# EasyEDA schematic Node Plant Project.json

## Sheets
1 DHT-11 & DHT-22: TITLE: Sheet_1; REV: 1.0; Date: 2024-01-26; Sheet: 1/1; Drawn By: robotic maker; Company: Your Company
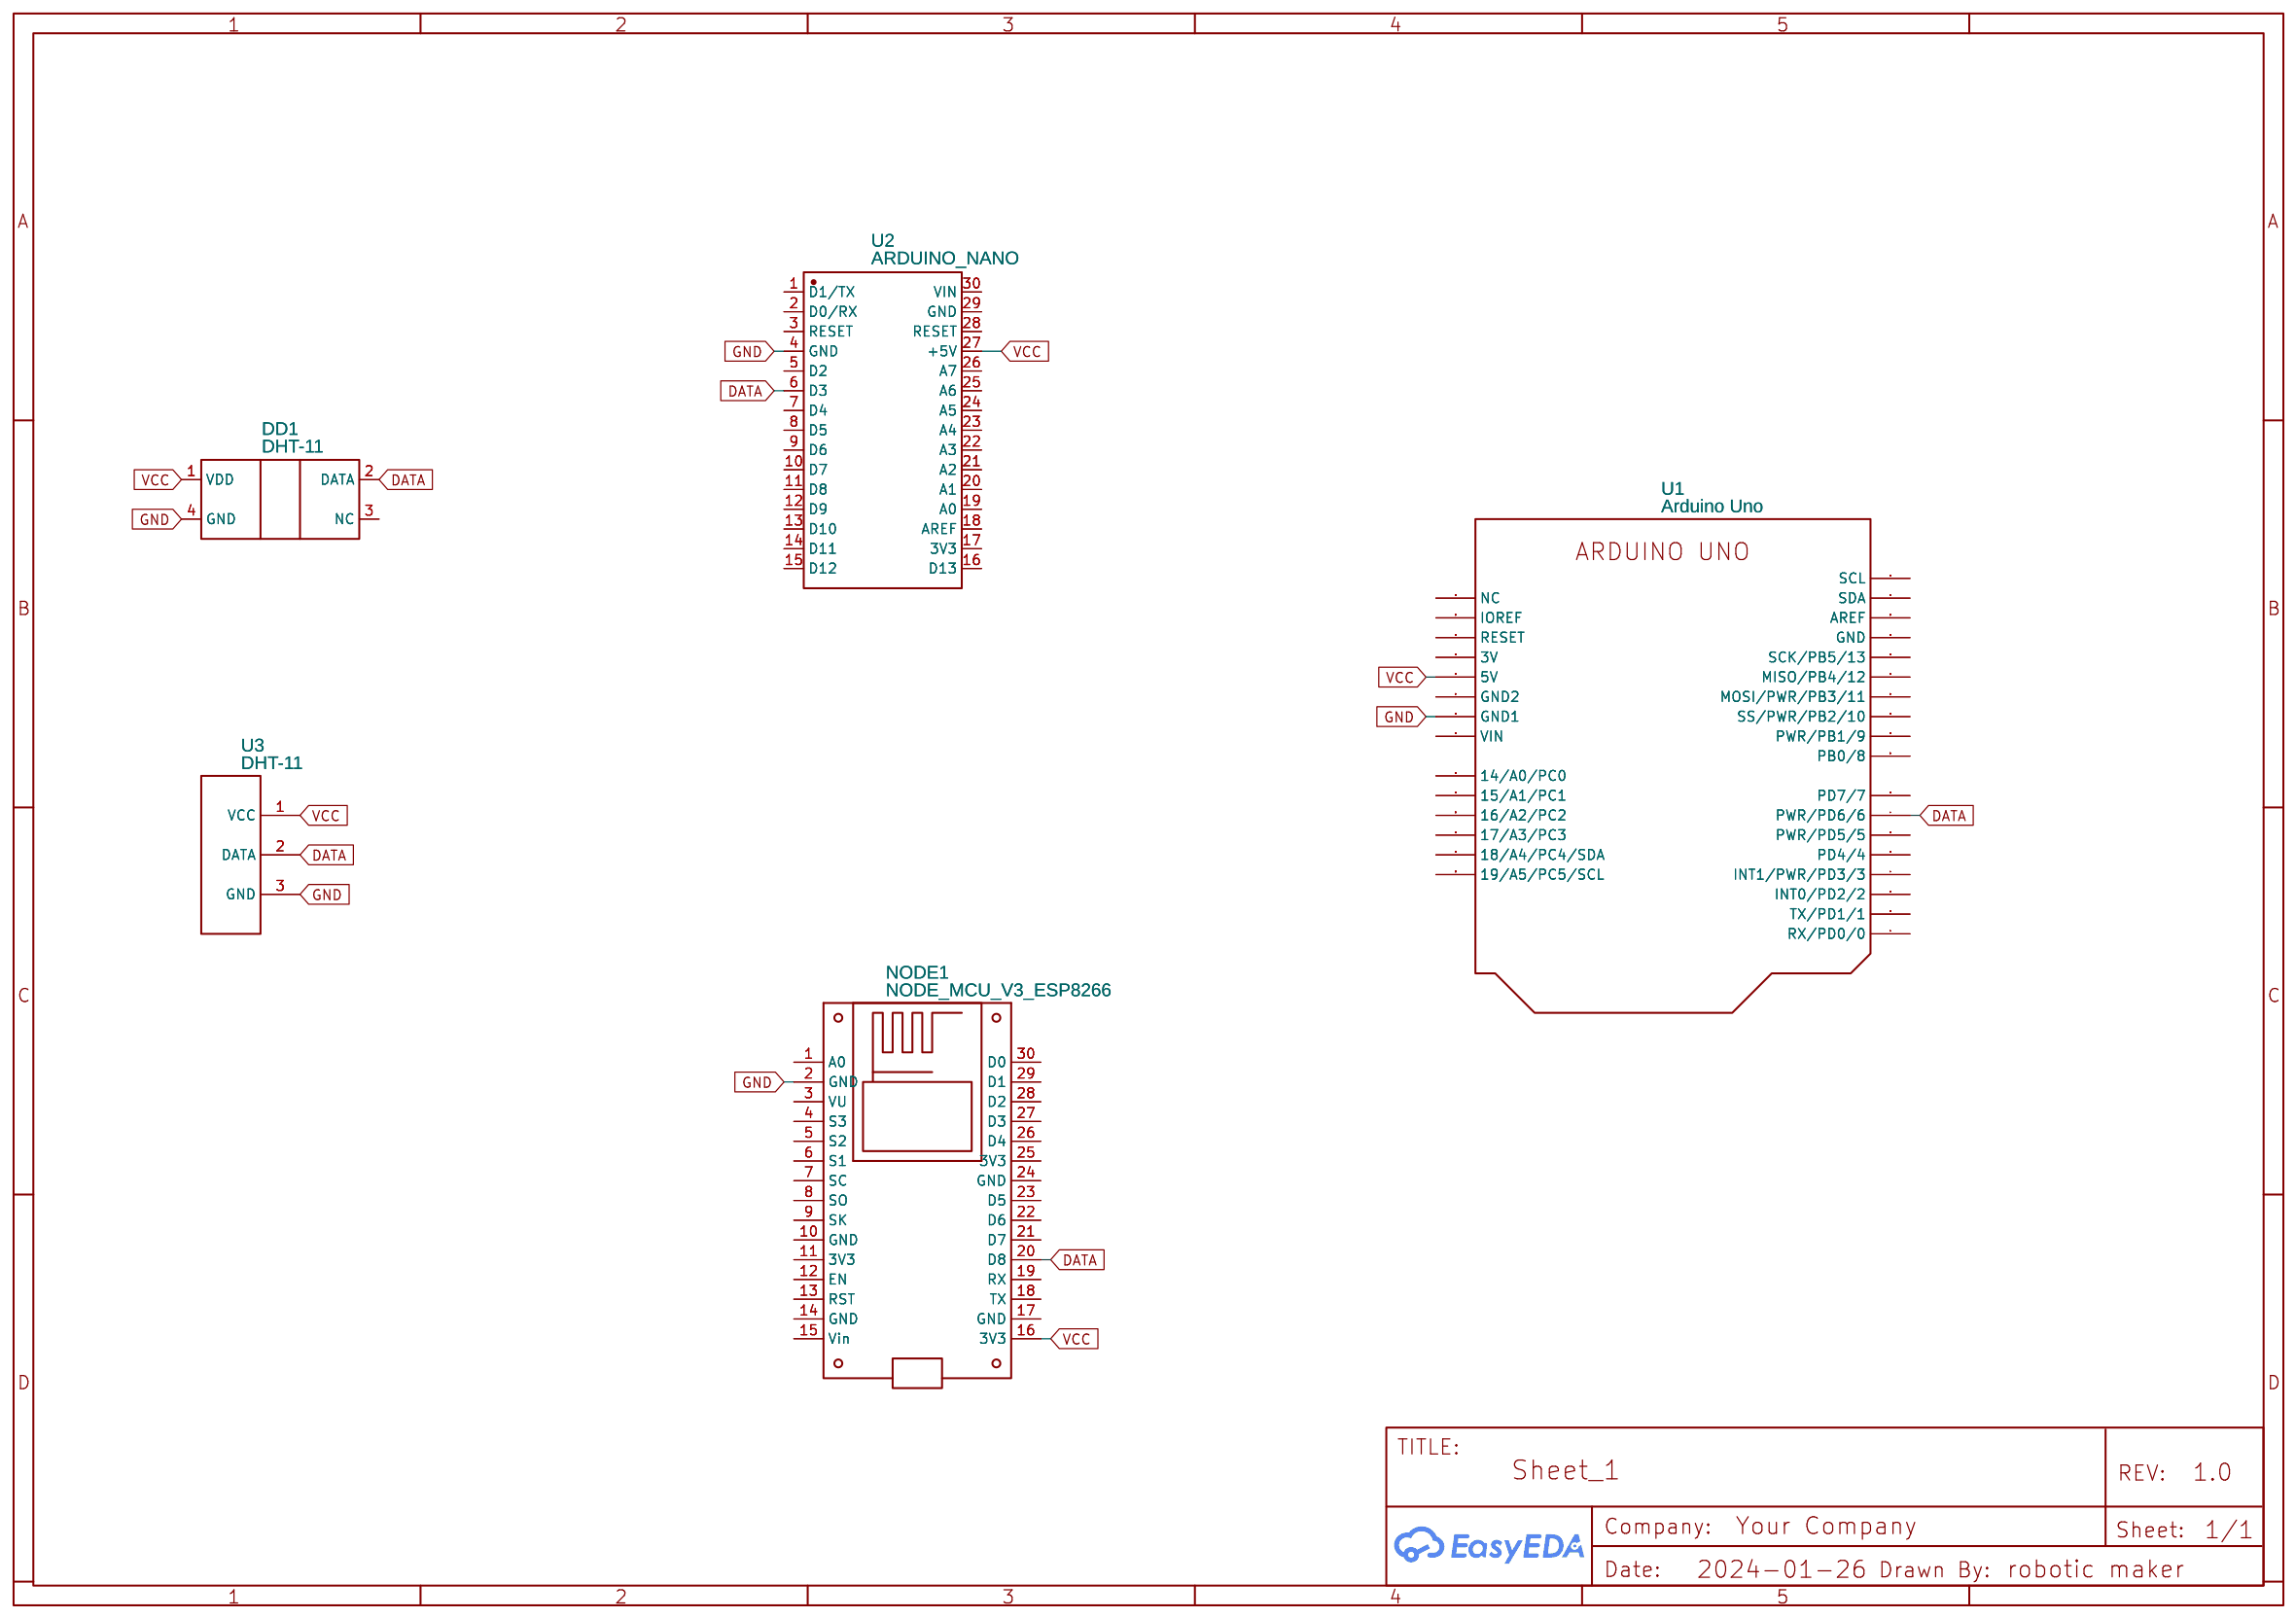
[diagram p0: DHT-11 & DHT-22]
2 Capacitive Soil Moisture Sensor
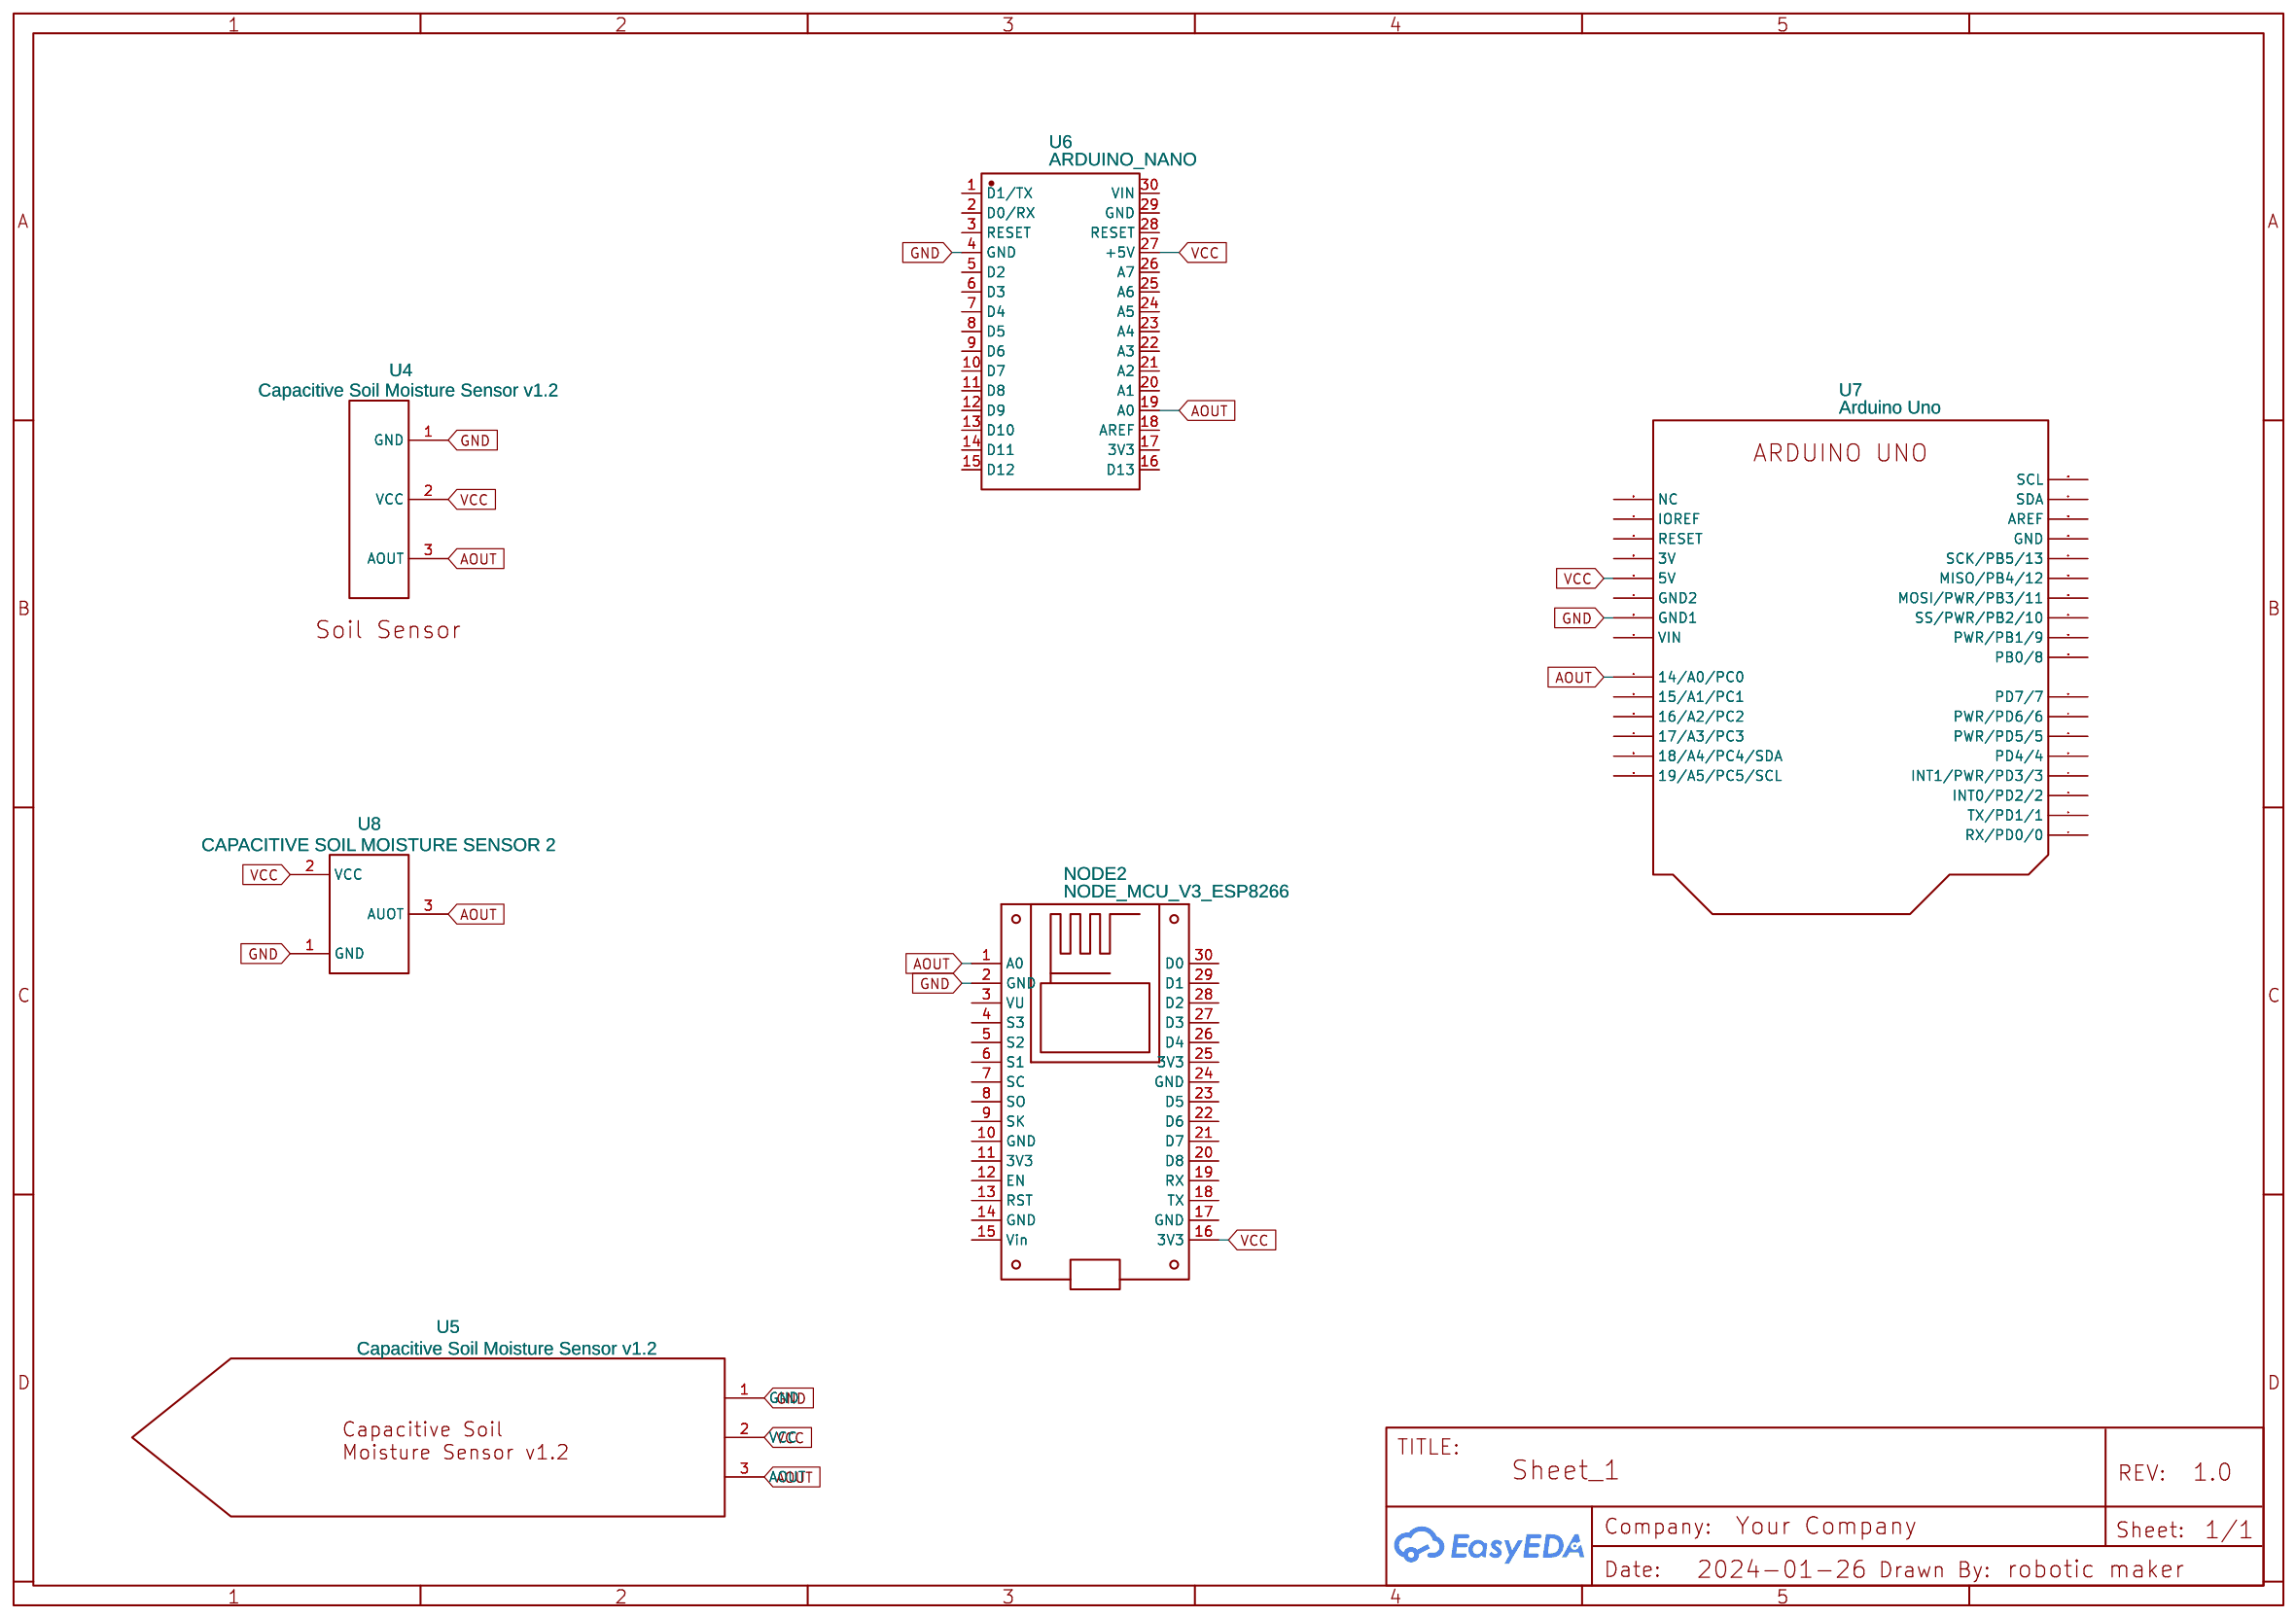
[diagram p1: Capacitive Soil Moisture Sensor]
3 Soil Moisture Sensor
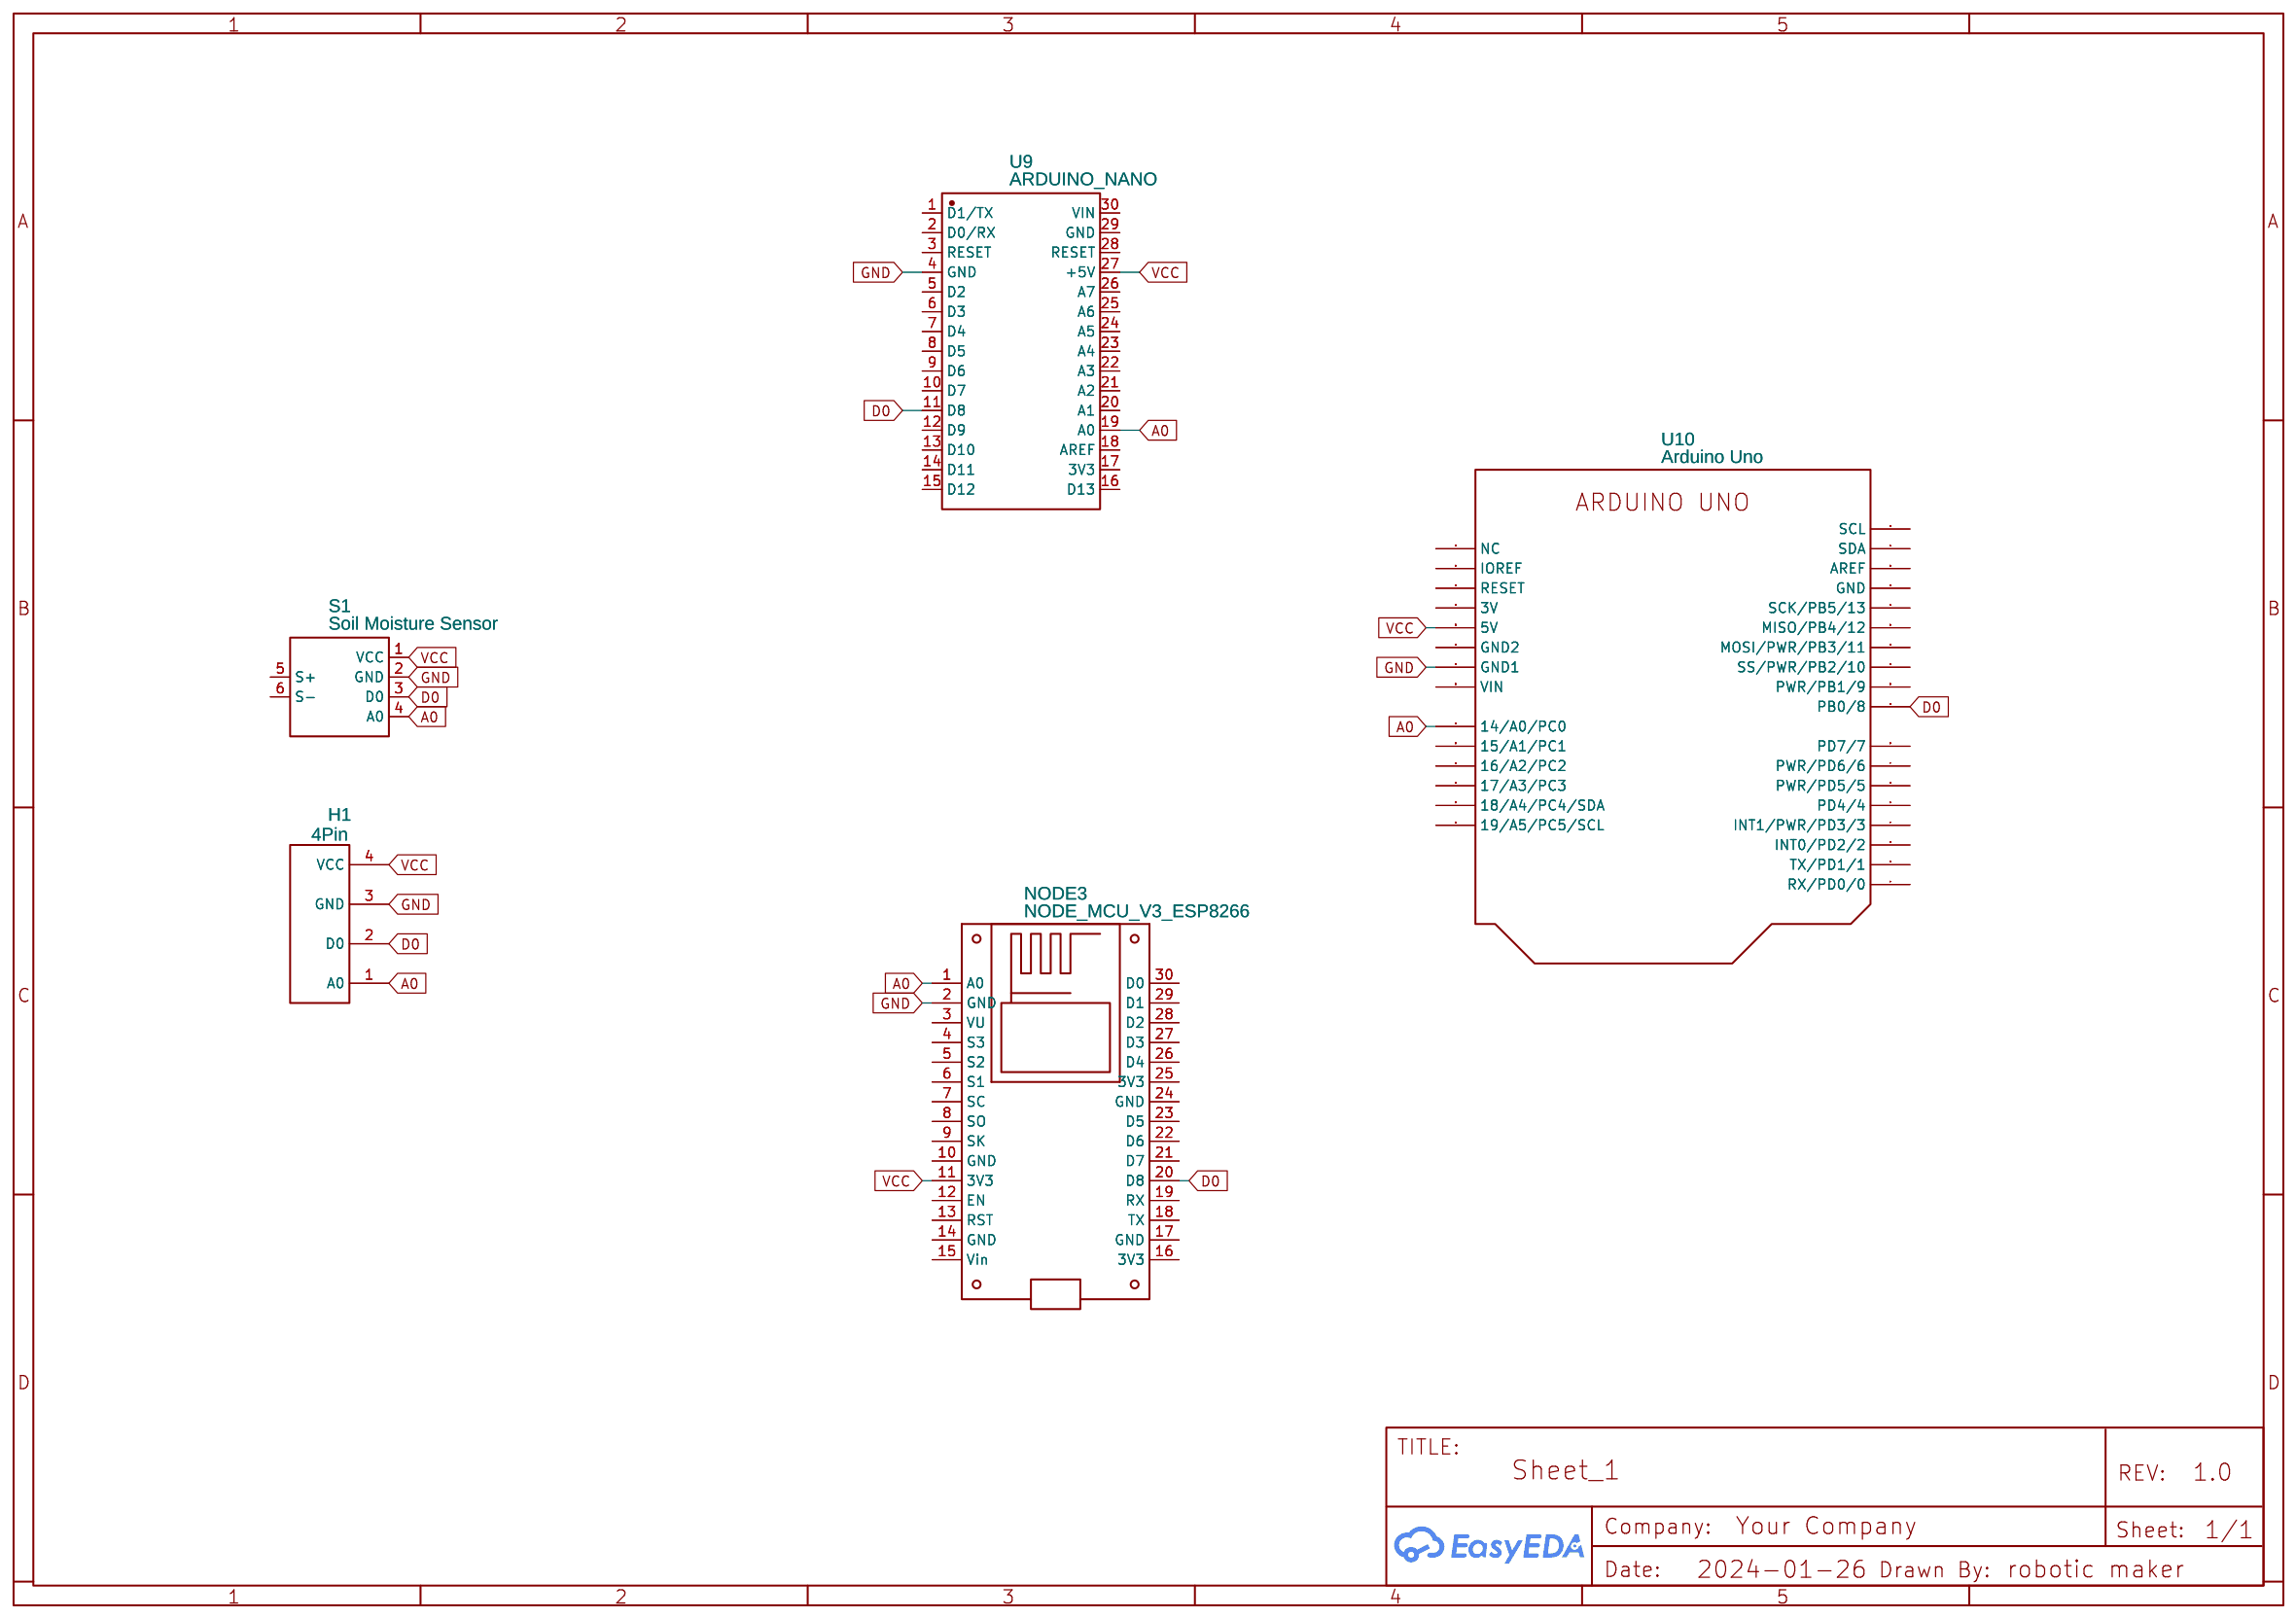
[diagram p2: Soil Moisture Sensor]
4 BH1750
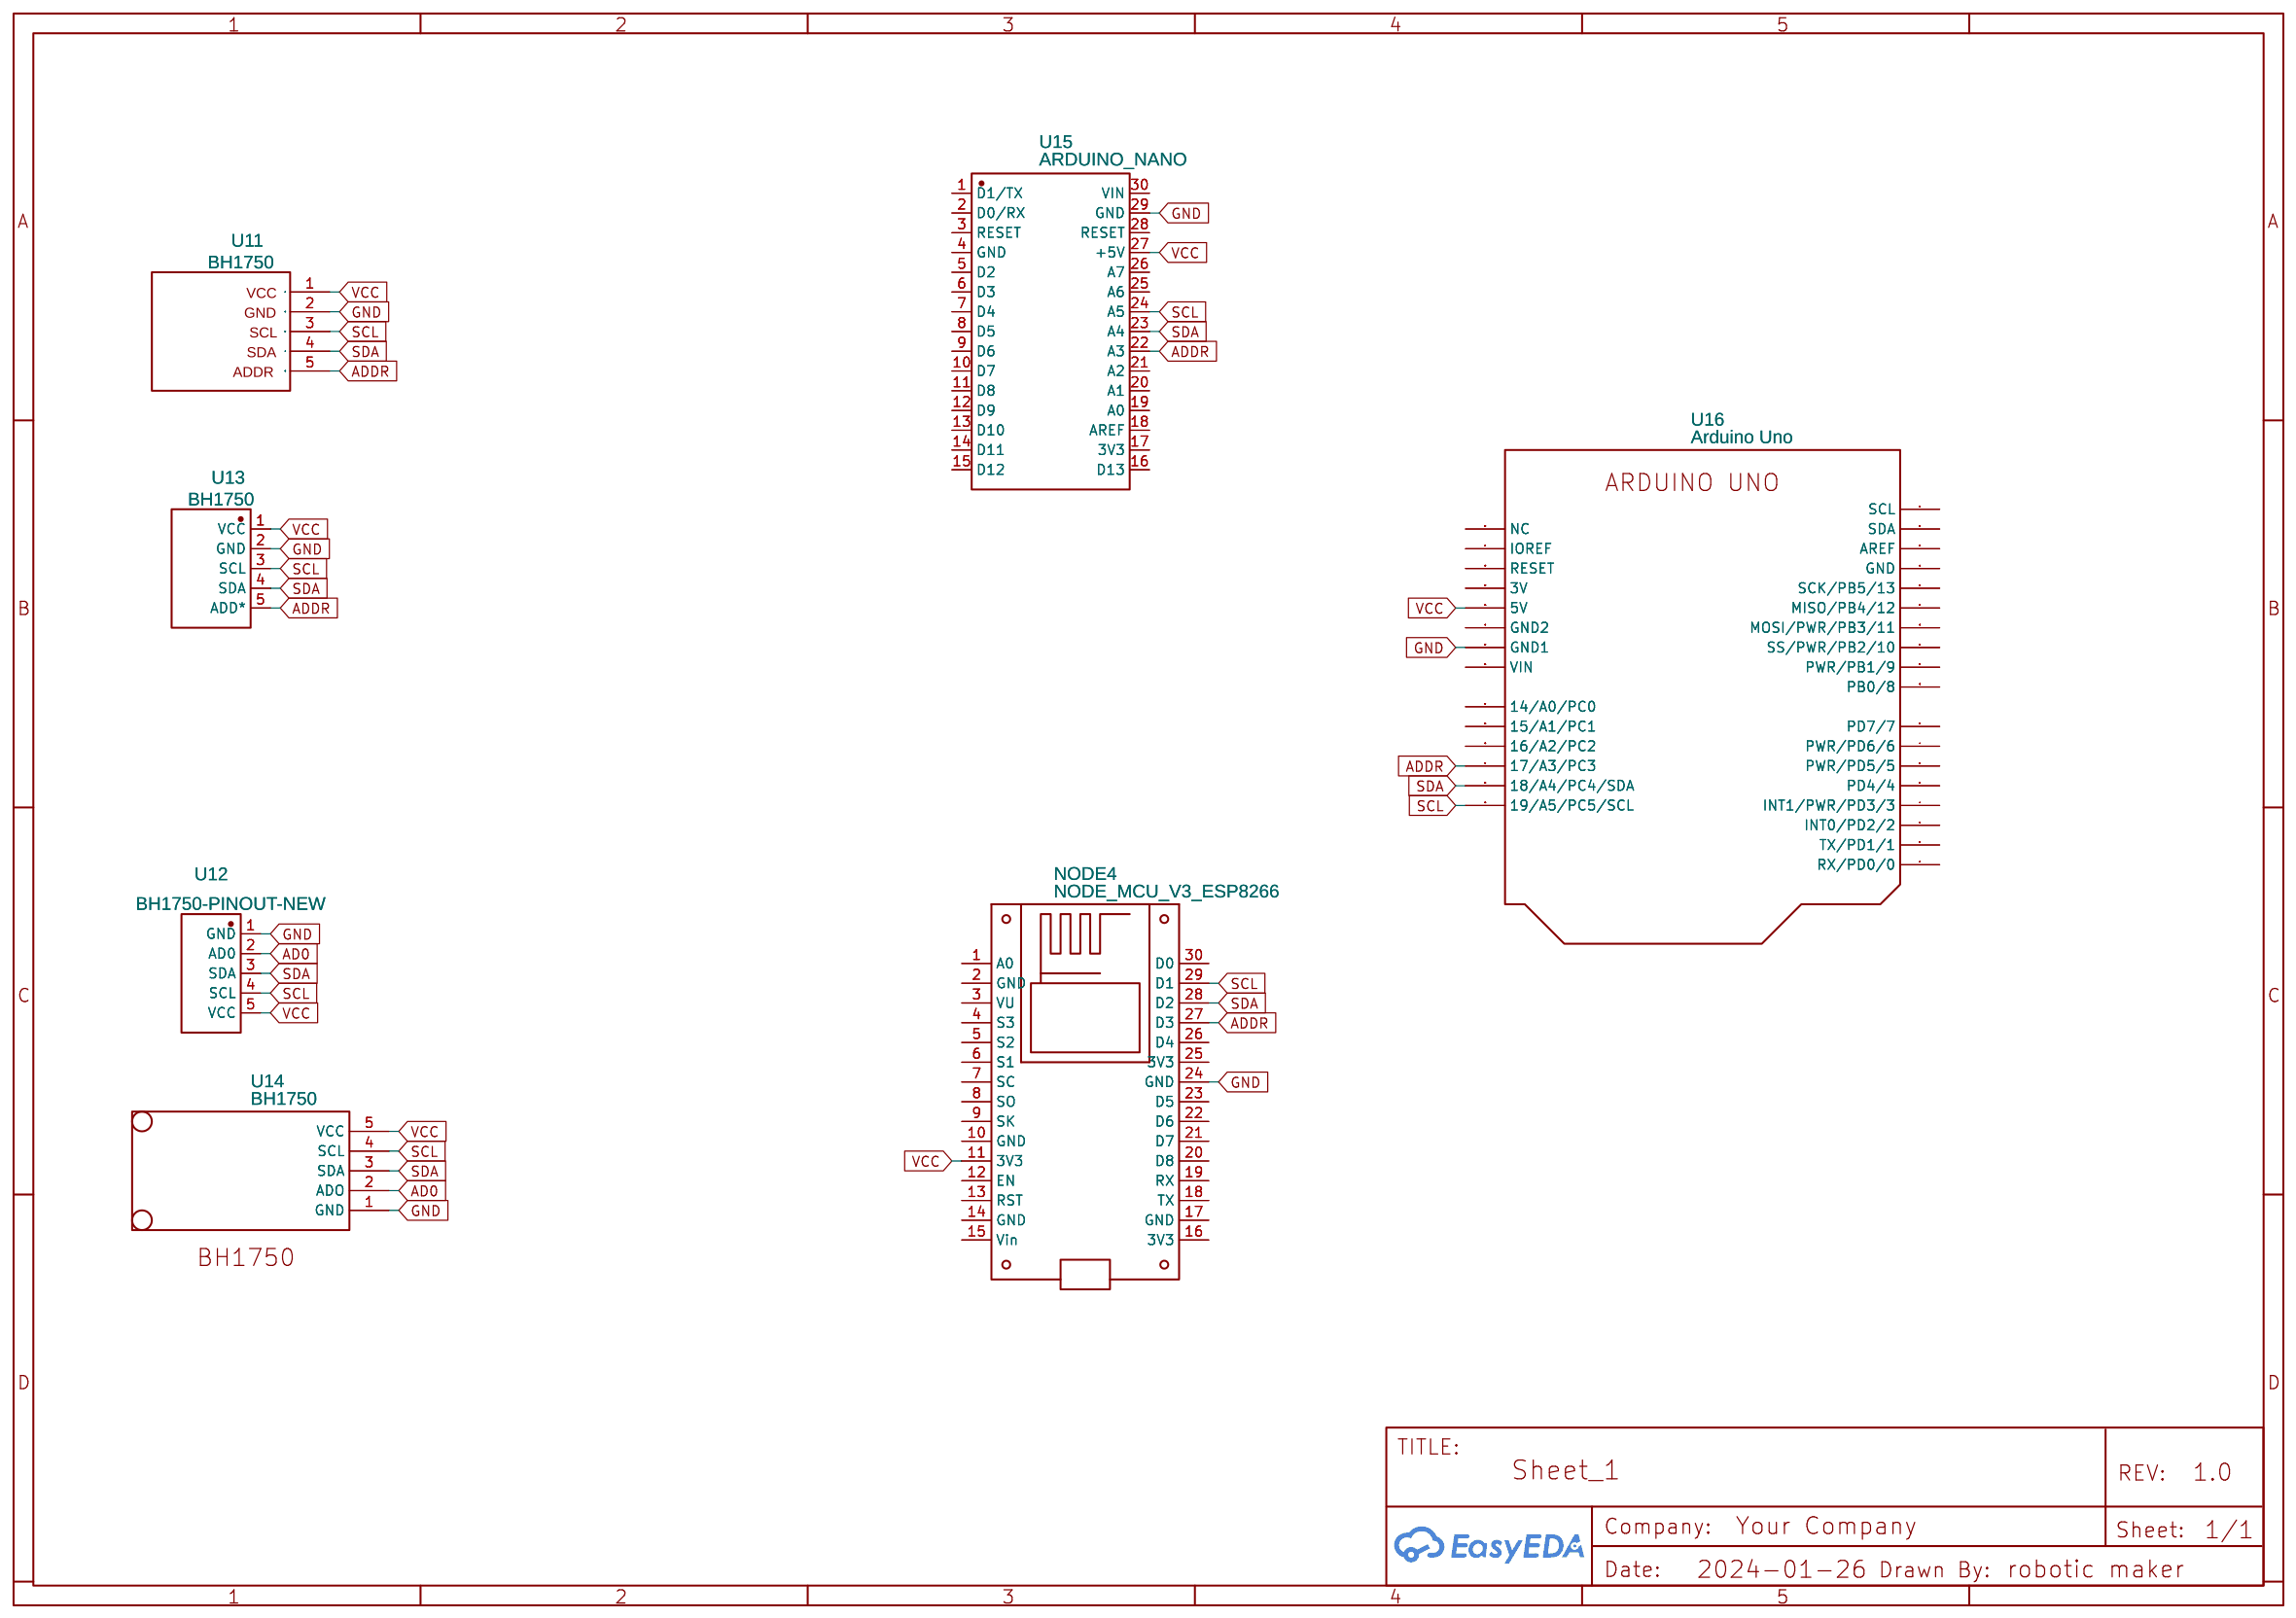
[diagram p3: BH1750]
5 Relay
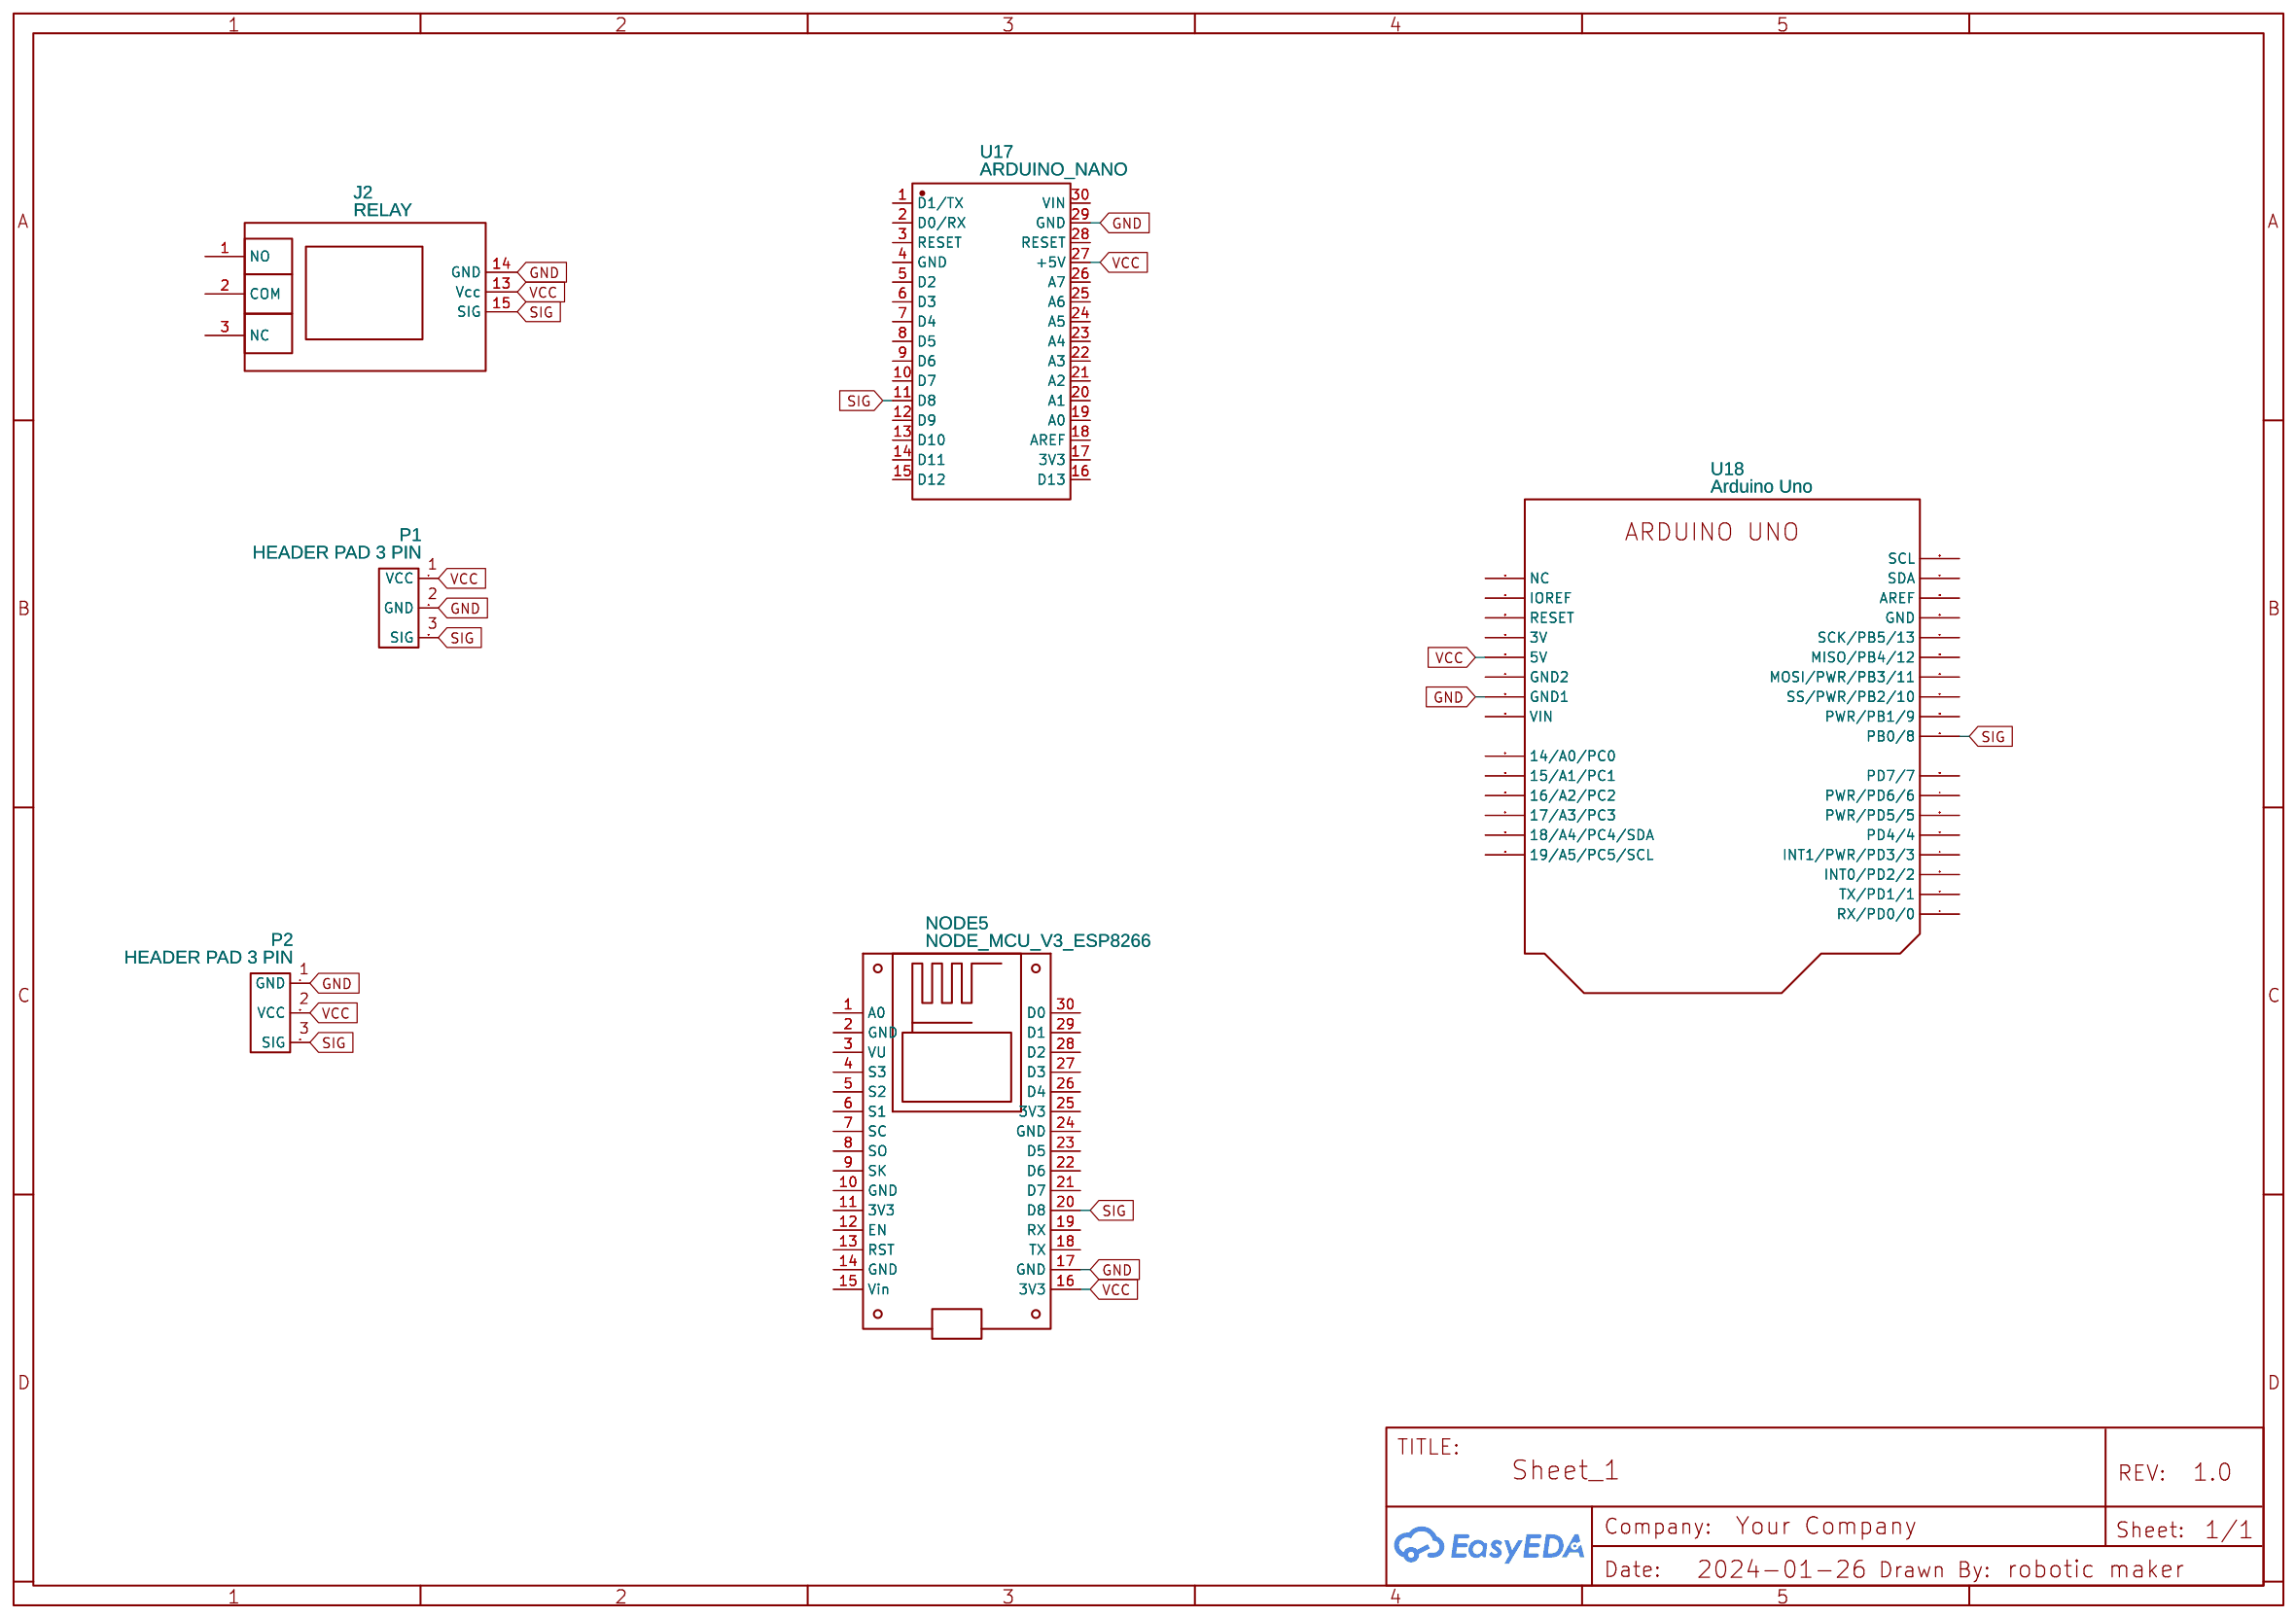
[diagram p4: Relay]
6 0.91 INCH OLED Display
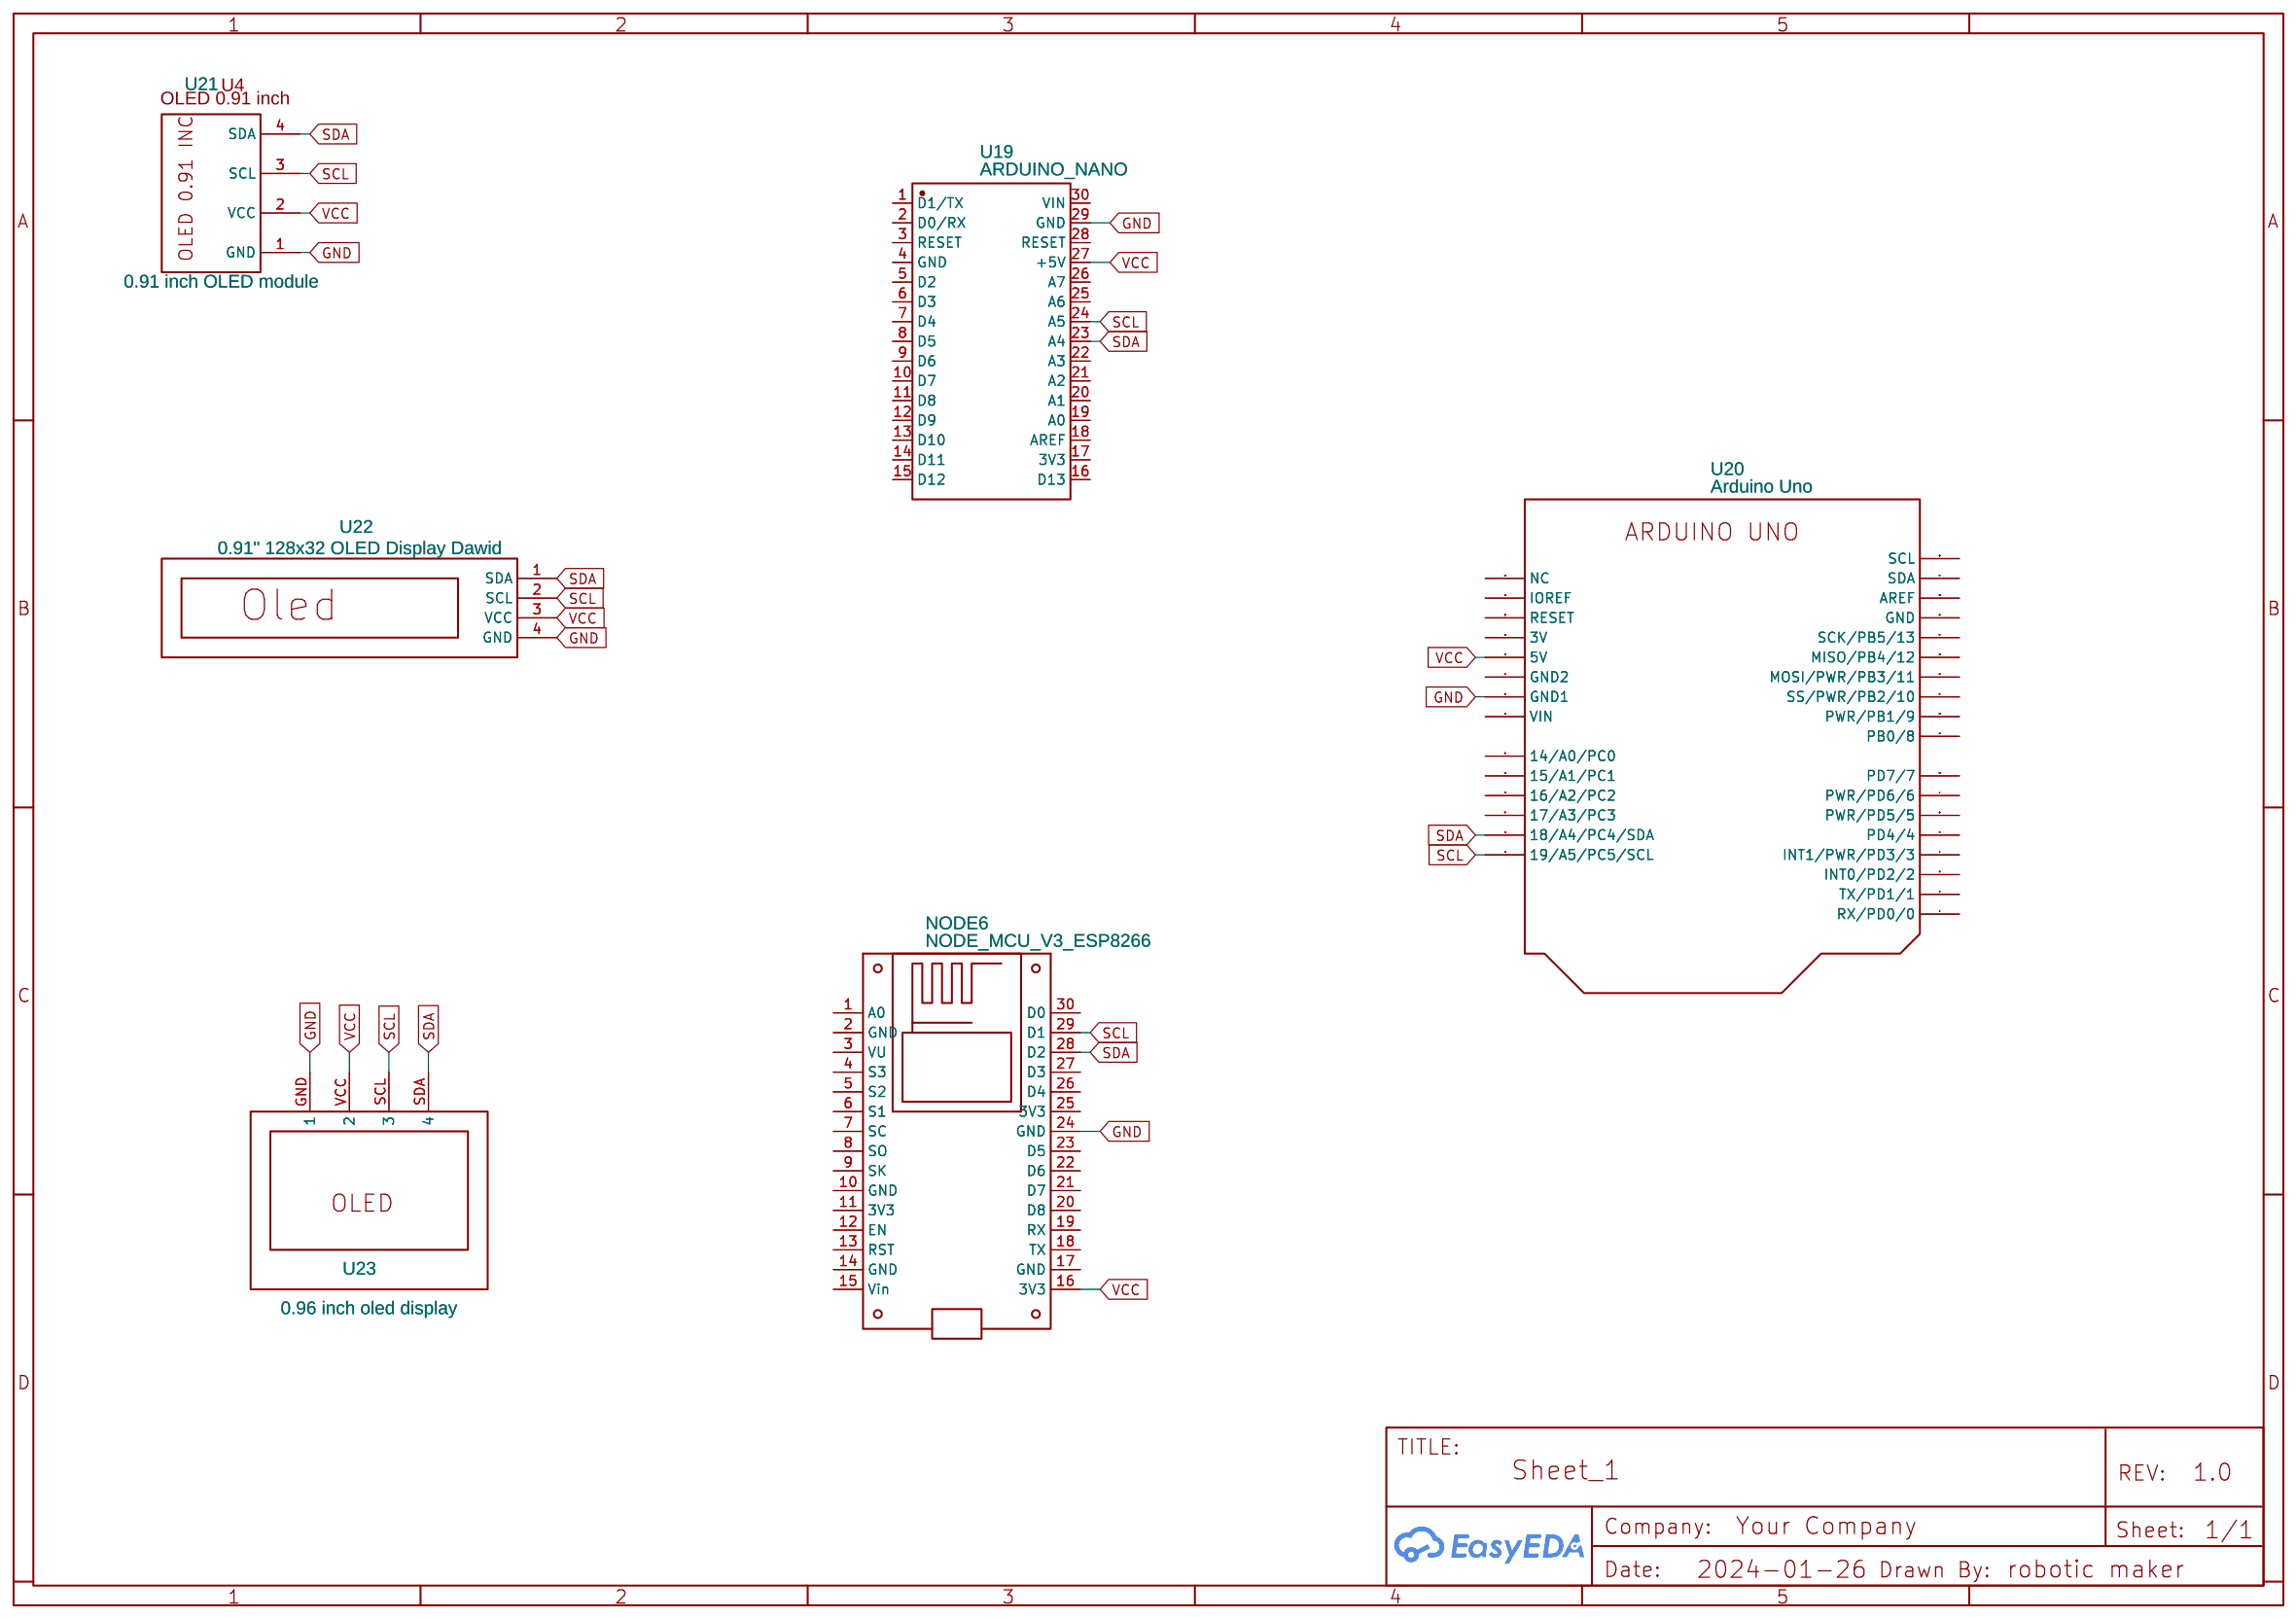
[diagram p5: 0.91 INCH OLED Display]
7 16X2 LCD Display
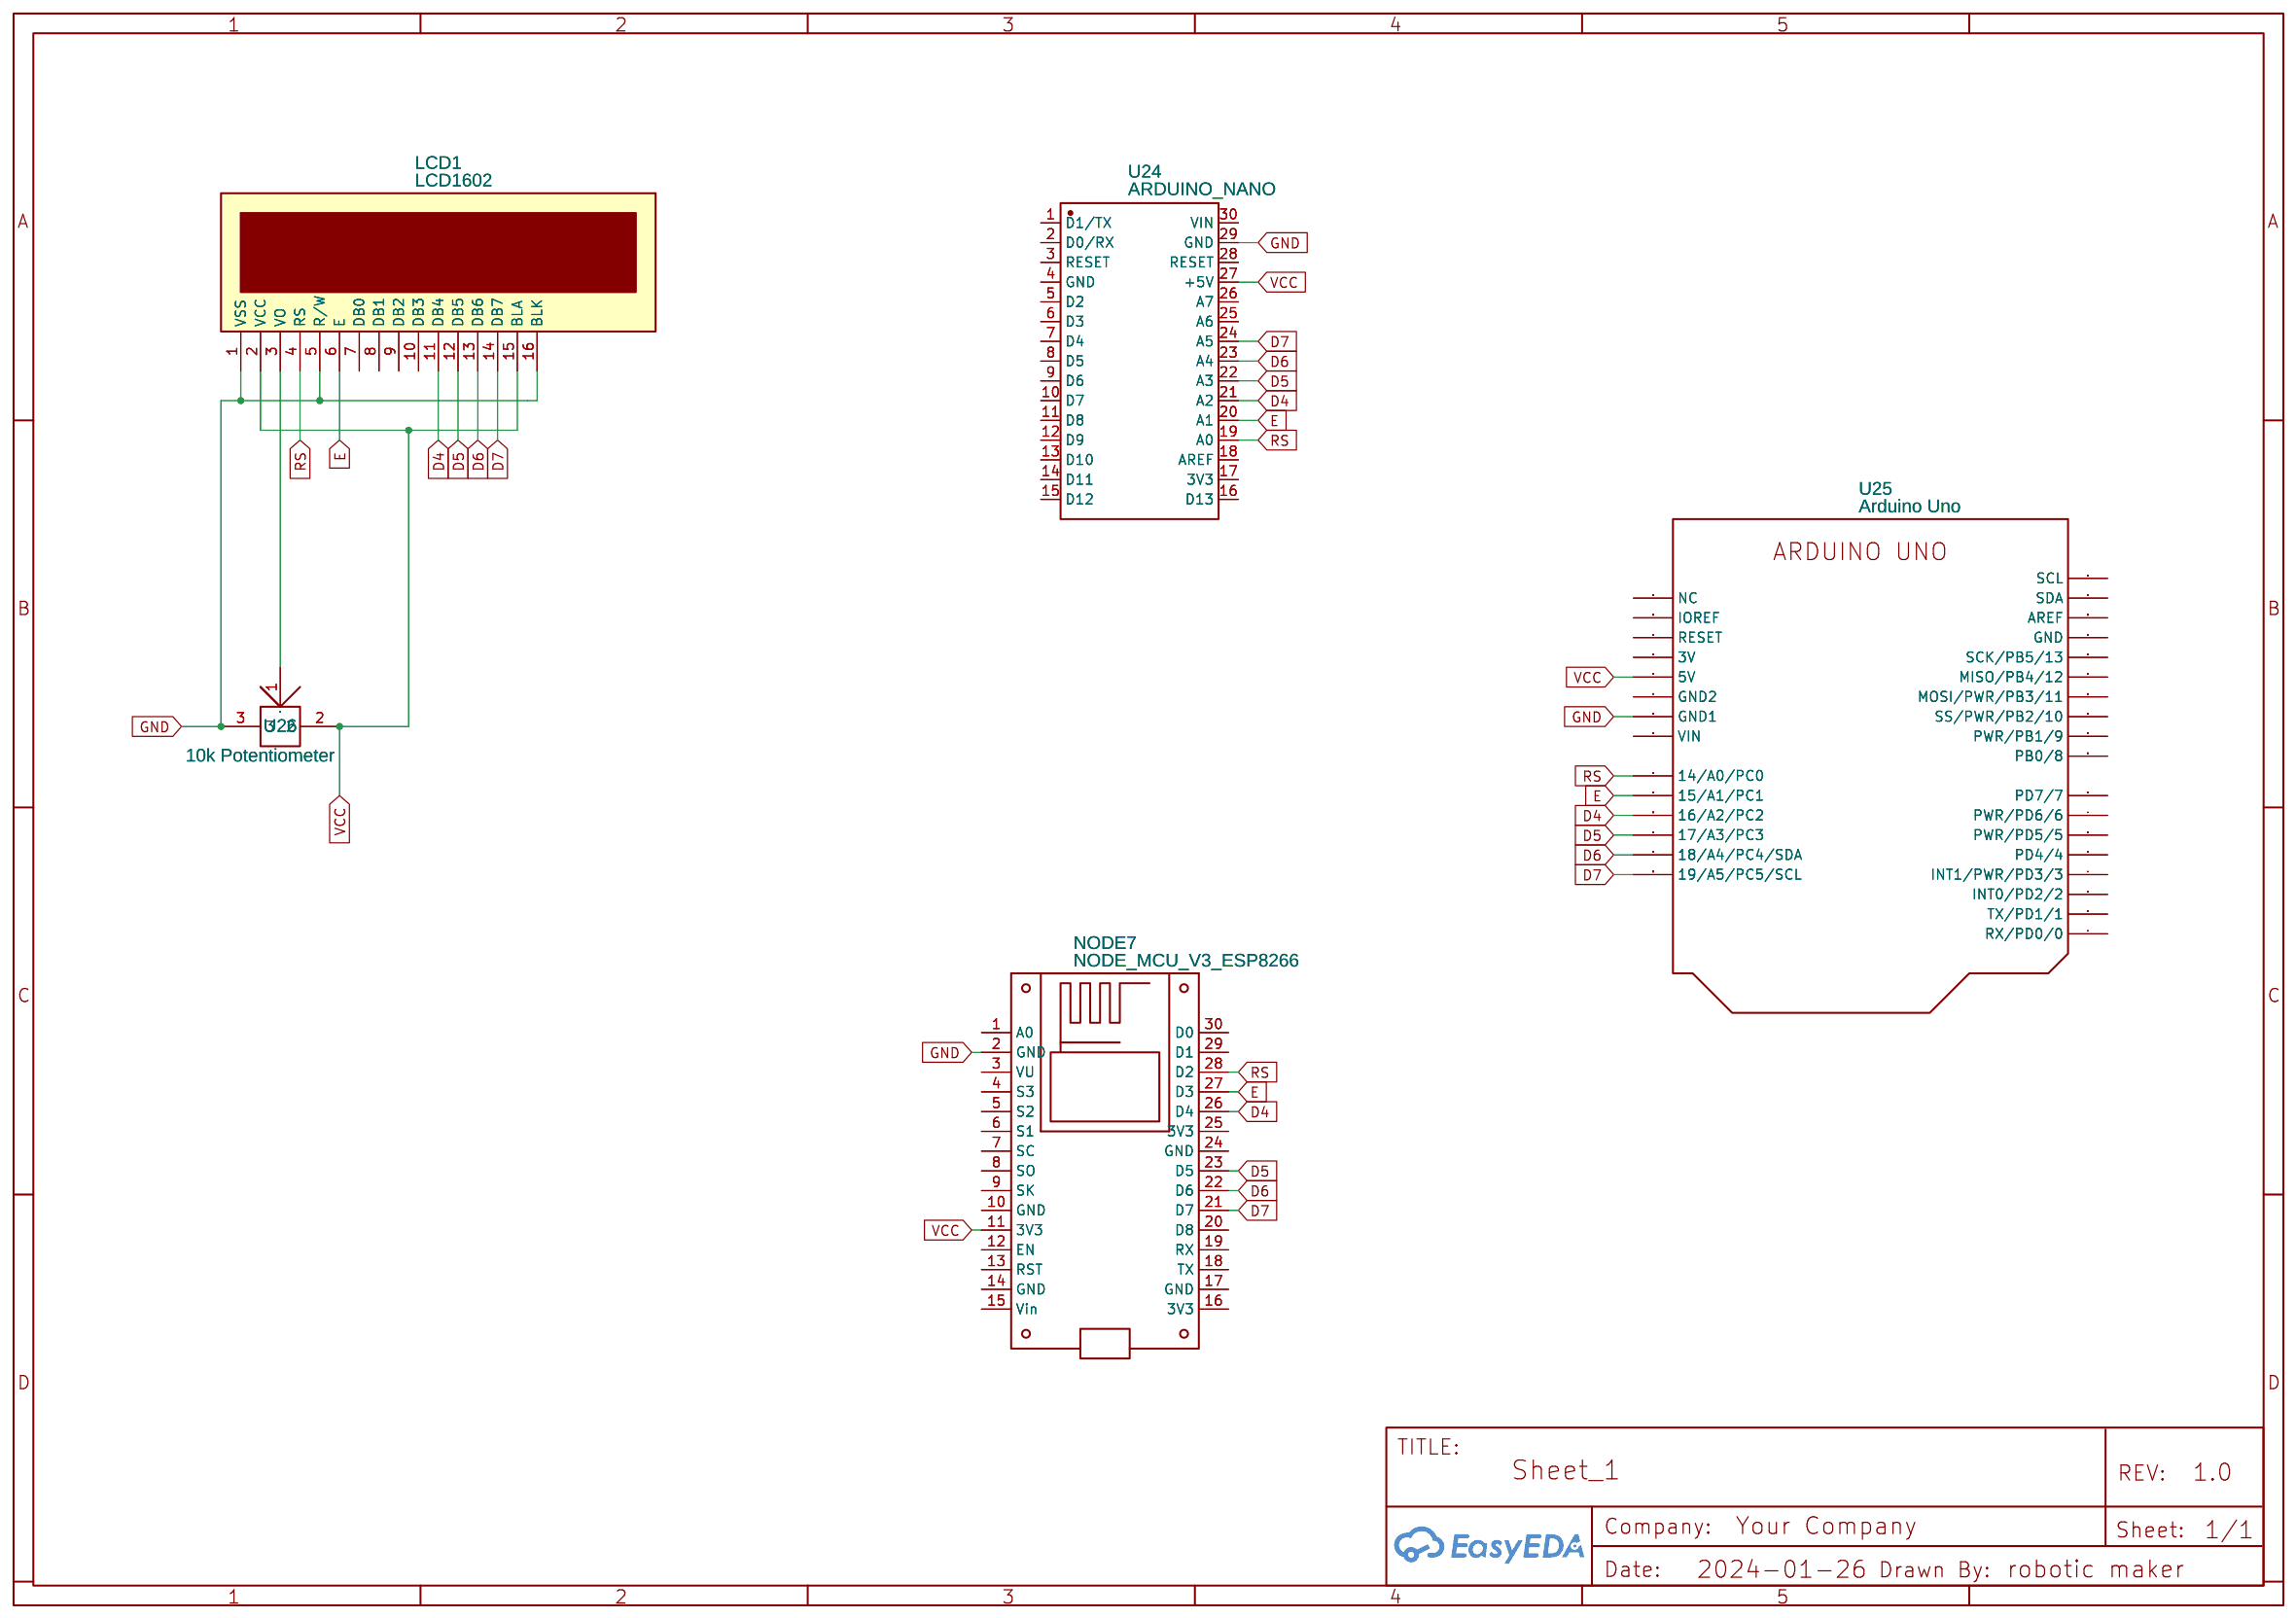
[diagram p6: 16X2 LCD Display]
8 16X2 LCD Display I2C
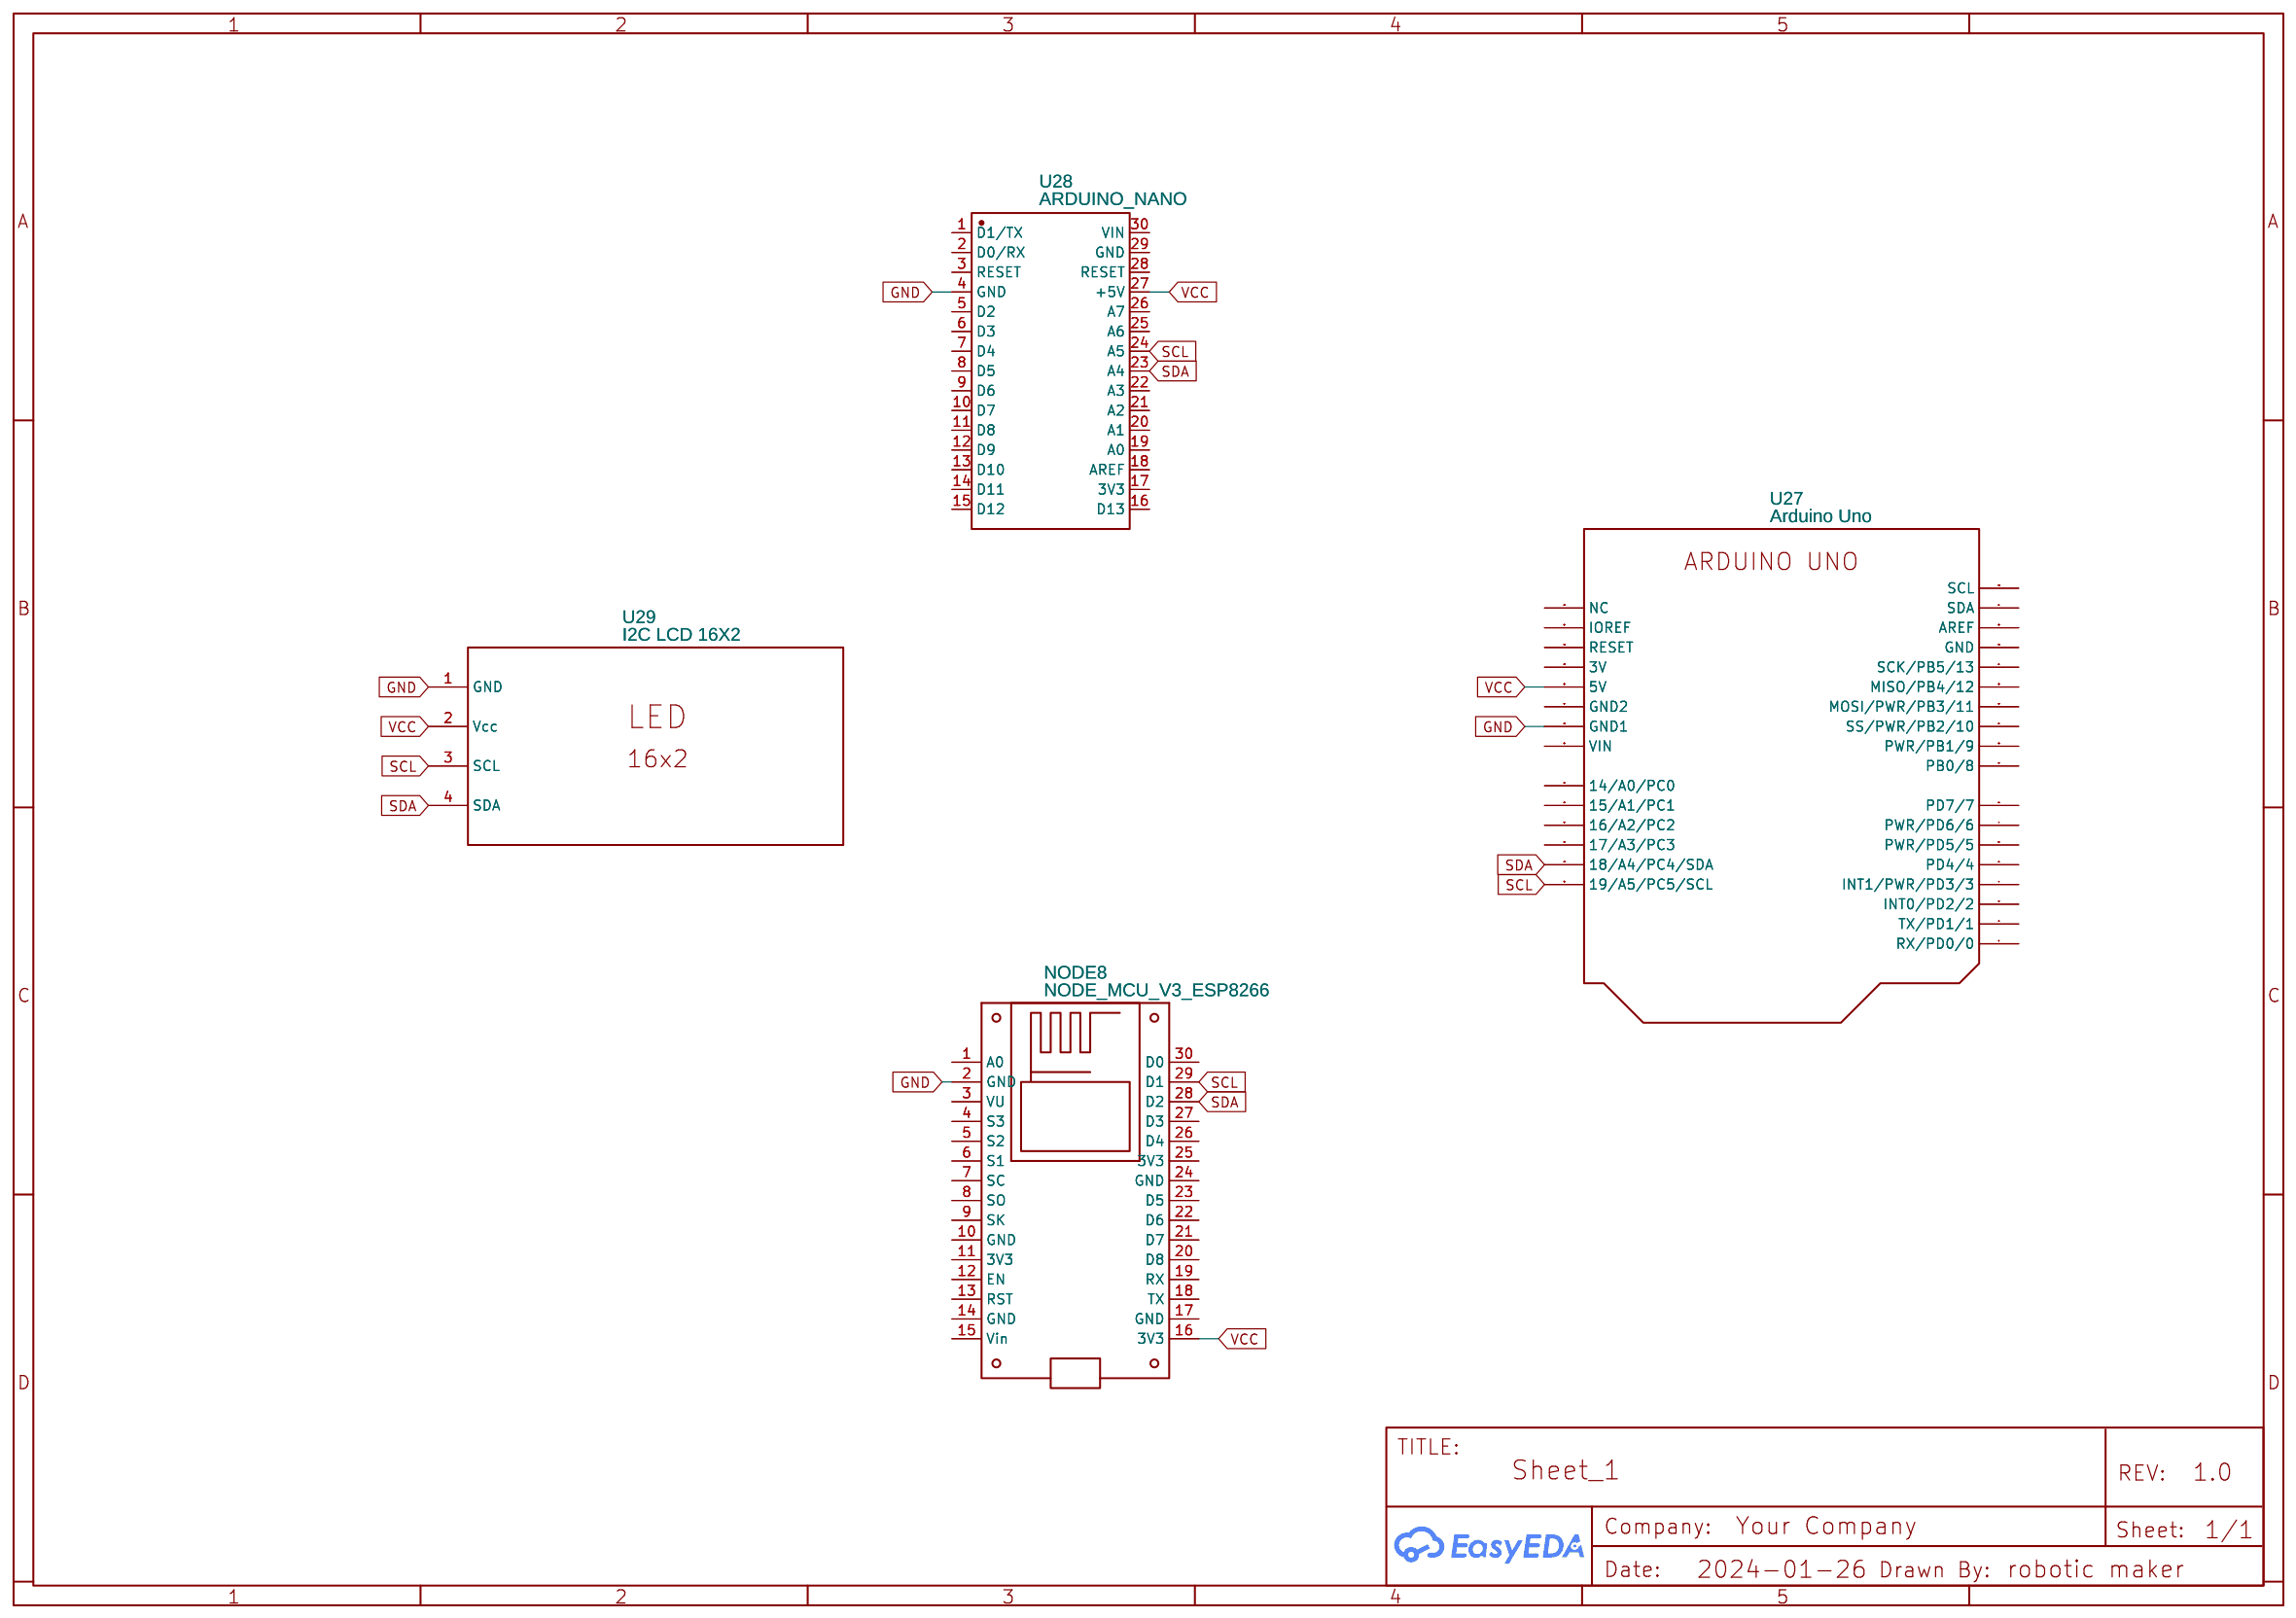
[diagram p7: 16X2 LCD Display I2C]

## Parts
sheet 0.91 INCH OLED Display
NODE6  NODE_MCU_V3_ESP8266  [NODEMCU-12E;NODEMCU-ESP8266]
U19  ARDUINO_NANO  [COMM-TH_ARDUINO_NANO]
U20  Arduino Uno  [UNO_R3;WO ARDUINO UNO]
U21  0.91 inch OLED module  [0.91 INCH OLED MODULE]
U22  0.91" 128x32 OLED Display Dawid  [0.91" 128X32 OLED DISPLAY DAWID]
U23  0.96 inch oled display  [0.96 INCH OLED DISPLAY]
sheet 16X2 LCD Display I2C
NODE8  NODE_MCU_V3_ESP8266  [NODEMCU-12E;NODEMCU-ESP8266]
U27  Arduino Uno  [UNO_R3;WO ARDUINO UNO]
U28  ARDUINO_NANO  [COMM-TH_ARDUINO_NANO]
U29  I2C LCD 16X2  [LCD_16X2_I2C_V2]
sheet 16X2 LCD Display
LCD1  LCD1602  [LCD1602]
NODE7  NODE_MCU_V3_ESP8266  [NODEMCU-12E;NODEMCU-ESP8266]
U24  ARDUINO_NANO  [COMM-TH_ARDUINO_NANO]
U25  Arduino Uno  [UNO_R3;WO ARDUINO UNO]
U26  10k Potentiometer  [10K POTENTIOMETER]
sheet BH1750
NODE4  NODE_MCU_V3_ESP8266  [NODEMCU-12E;NODEMCU-ESP8266]
U11  BH1750  [BH1750]
U12  BH1750-PINOUT-NEW  [BH1750-PINOUT-F]
U13  BH1750  [BH1750_MODULE]
U14  BH1750  [BH1750]
U15  ARDUINO_NANO  [COMM-TH_ARDUINO_NANO]
U16  Arduino Uno  [UNO_R3;WO ARDUINO UNO]
sheet Capacitive Soil Moisture Sensor
NODE2  NODE_MCU_V3_ESP8266  [NODEMCU-12E;NODEMCU-ESP8266]
U4  Capacitive Soil Moisture Sensor v1.2  [CAPACITIVE SOIL MOISTURE SENSOR V1.2 PCB]
U5  Capacitive Soil Moisture Sensor v1.2
U6  ARDUINO_NANO  [COMM-TH_ARDUINO_NANO]
U7  Arduino Uno  [UNO_R3;WO ARDUINO UNO]
U8  CAPACITIVE SOIL MOISTURE SENSOR 2  [CAPACITIVE SOIL MOISTURE SENSOR LAYOUT 2]
sheet DHT-11 & DHT-22
DD1  DHT-11  [DHT11F]
NODE1  NODE_MCU_V3_ESP8266  [NODEMCU-12E;NODEMCU-ESP8266]
U1  Arduino Uno  [UNO_R3;WO ARDUINO UNO]
U2  ARDUINO_NANO  [COMM-TH_ARDUINO_NANO]
U3  DHT-11  [DHT-11]
sheet Relay
J2  RELAY  [RELAY MODULE 1 RELAYS]
NODE5  NODE_MCU_V3_ESP8266  [NODEMCU-12E;NODEMCU-ESP8266]
P1  HEADER PAD 3 PIN  [CONNECTOR_PINHEADER_2.54MM:PINHEADER_1X3]
P2  HEADER PAD 3 PIN  [CONNECTOR_PINHEADER_2.54MM:PINHEADER_1X3]
U17  ARDUINO_NANO  [COMM-TH_ARDUINO_NANO]
U18  Arduino Uno  [UNO_R3;WO ARDUINO UNO]
sheet Soil Moisture Sensor
H1  4Pin  [HEADERPIN4PIN]
NODE3  NODE_MCU_V3_ESP8266  [NODEMCU-12E;NODEMCU-ESP8266]
S1  Soil Moisture Sensor  [SOIL MOISTURE SENSOR]
U9  ARDUINO_NANO  [COMM-TH_ARDUINO_NANO]
U10  Arduino Uno  [UNO_R3;WO ARDUINO UNO]

## Library data of the parts
NODE1-NODE8 = NODE_MCU_V3_ESP8266: Contributor: Denis09; Supplier: TME
U2 U6 U9 U15 U17 U19 U24 U28 = ARDUINO_NANO: Contributor: lcsc; Supplier: LCSC; Supplier Part: C9900017879; Manufacturer: null; JLCPCB Part Class: Extended Part
U1 U7 U10 U16 U18 U20 U25 U27 = Arduino Uno: Contributor: Peter Story; sourceId: frlCUcuMG
U21 = 0.91 inch OLED module: Contributor: Мурат Еньков
U22 = 0.91" 128x32 OLED Display Dawid: Contributor: dawidbredenkamp
U23 = 0.96 inch oled display: Contributor: noorul_haque
U29 = I2C LCD 16X2: Contributor: vipe
LCD1 = LCD1602: Manufacturer: LONTECH(厦门龙特); Manufacturer Part: LCM1602K-NSW-BBW; Supplier Part: C83275; Supplier: LCSC; Contributor: LCEDA_Lib
U26 = 10k Potentiometer: Contributor: Sagar Karnewar
U11 = BH1750: Contributor: jesuschoy
U12 = BH1750-PINOUT-NEW: Manufacturer Part: New SchematicLib; Contributor: sm94126; Supplier: Tinytronics
U13 = BH1750: Contributor: dwipanjan
U14 = BH1750: Supplier: RS-Online; Contributor: SRY TIS
U4 = Capacitive Soil Moisture Sensor v1.2: Contributor: Pablo Avila
U5 = Capacitive Soil Moisture Sensor v1.2: Contributor: Franiel
U8 = CAPACITIVE SOIL MOISTURE SENSOR 2: Contributor: phatcomp_it
DD1 = DHT-11: Contributor: perchik36
U3 = DHT-11: Contributor: UzainYasin
J2 = RELAY: Manufacturer Part: 1-Channel 5V Relay Module w/ Opto-isolator; Supplier Part: SKU: 223429; link: http://www.volumerate.com/product/1-channel-5v-relay-module-w-opto-isolator-red-blue-223429; Contributor: Jehangirkhan
P1 P2 = HEADER PAD 3 PIN: Supplier: LCSC; Manufacturer: BOOMELE; Manufacturer Part: Female headerHDR1X8-2.54; Supplier Part: C27438; JLCPCB Part Class: Extended Part; Contributor: vincentboisselier
H1 = 4Pin: Supplier: Hestore; Supplier Part: ZL201; Contributor: hunkrekker
S1 = Soil Moisture Sensor: Contributor: r.teerapong5456

## Nets
GND: DD1.4(GND) H1.3(GND) J2.14(GND) LCD1.1(VSS) LCD1.5(R/W) LCD1.16(BLK) NODE1.2(GND) NODE2.2(GND) NODE3.2(GND) NODE4.24(GND) NODE5.17(GND) NODE6.24(GND) NODE7.2(GND) NODE8.2(GND) P1.2(GND) P2.1(GND) S1.2(GND) U1.26(GND1) U2.4(GND) U3.3(GND) U4.1(GND) U6.4(GND) U7.26(GND1) U8.1(GND) U9.4(GND) U10.26(GND1) U11.2 U12.1(GND) U13.2(GND) U14.1(GND) U15.29(GND) U16.26(GND1) U17.29(GND) U18.26(GND1) U19.29(GND) U20.26(GND1) U21.1(GND) U22.4(GND) U23.GND(1) U24.29(GND) U25.26(GND1) U26.3 U27.26(GND1) U28.4(GND) U29.1(GND)
VCC: DD1.1(VDD) H1.4(VCC) J2.13(Vcc) LCD1.2(VCC) LCD1.15(BLA) NODE1.16(3V3) NODE2.16(3V3) NODE3.11(3V3) NODE4.11(3V3) NODE5.16(3V3) NODE6.16(3V3) NODE7.11(3V3) NODE8.16(3V3) P1.1(VCC) P2.2(VCC) S1.1(VCC) U1.28(5V) U2.27(+5V) U3.1(VCC) U4.2(VCC) U6.27(+5V) U7.28(5V) U8.2(VCC) U9.27(+5V) U10.28(5V) U11.1 U12.5(VCC) U13.1(VCC) U14.5(VCC) U15.27(+5V) U16.28(5V) U17.27(+5V) U18.28(5V) U19.27(+5V) U20.28(5V) U21.2(VCC) U22.3(VCC) U23.VCC(2) U24.27(+5V) U25.28(5V) U26.2 U27.28(5V) U28.27(+5V) U29.2(Vcc)
A0: H1.1(A0) NODE3.1(A0) S1.4(A0) U9.19(A0) U10.24(14/A0/PC0)
AD0: U12.2(AD0) U14.2(ADO)
ADDR: NODE4.27(D3) U11.5 U13.5(ADD*) U15.22(A3) U16.21(17/A3/PC3)
AOUT: NODE2.1(A0) U4.3(AOUT) U6.19(A0) U7.24(14/A0/PC0) U8.3(AUOT)
D0: H1.2(D0) NODE3.20(D8) S1.3(D0) U9.11(D8) U10.9(PB0/8)
D4: LCD1.11(DB4) NODE7.26(D4) U24.21(A2) U25.22(16/A2/PC2)
D5: LCD1.12(DB5) NODE7.23(D5) U24.22(A3) U25.21(17/A3/PC3)
D6: LCD1.13(DB6) NODE7.22(D6) U24.23(A4) U25.20(18/A4/PC4/SDA)
D7: LCD1.14(DB7) NODE7.21(D7) U24.24(A5) U25.19(19/A5/PC5/SCL)
DATA: DD1.2(DATA) NODE1.20(D8) U1.7(PWR/PD6/6) U2.6(D3) U3.2(DATA)
E: LCD1.6(E) NODE7.27(D3) U24.20(A1) U25.23(15/A1/PC1)
RS: LCD1.4(RS) NODE7.28(D2) U24.19(A0) U25.24(14/A0/PC0)
SCL: NODE4.29(D1) NODE6.29(D1) NODE8.29(D1) U11.3 U12.4(SCL) U13.3(SCL) U14.4(SCL) U15.24(A5) U16.19(19/A5/PC5/SCL) U19.24(A5) U20.19(19/A5/PC5/SCL) U21.3(SCL) U22.2(SCL) U23.SCL(3) U27.19(19/A5/PC5/SCL) U28.24(A5) U29.3(SCL)
SDA: NODE4.28(D2) NODE6.28(D2) NODE8.28(D2) U11.4 U12.3(SDA) U13.4(SDA) U14.3(SDA) U15.23(A4) U16.20(18/A4/PC4/SDA) U19.23(A4) U20.20(18/A4/PC4/SDA) U21.4(SDA) U22.1(SDA) U23.SDA(4) U27.20(18/A4/PC4/SDA) U28.23(A4) U29.4(SDA)
SIG: J2.15(SIG) NODE5.20(D8) P1.3(SIG) P2.3(SIG) U17.11(D8) U18.9(PB0/8)
Net-(LCD1-3): LCD1.3(VO) U26.1

Not connected (* = marked no-connect by the designer): DD1 3(NC); J2 1(NO) 2(COM) 3(NC); LCD1 7(DB0) 8(DB1) 9(DB2) 10(DB3); NODE1 1(A0) 3(VU) 4(S3) 5(S2) 6(S1) 7(SC) 8(SO) 9(SK) 10(GND) 11(3V3) 12(EN) 13(RST) 14(GND) 15(Vin) 17(GND) 18(TX) 19(RX) 21(D7) 22(D6) 23(D5) 24(GND) 25(3V3) 26(D4) 27(D3) 28(D2) 29(D1) 30(D0); NODE2 3(VU) 4(S3) 5(S2) 6(S1) 7(SC) 8(SO) 9(SK) 10(GND) 11(3V3) 12(EN) 13(RST) 14(GND) 15(Vin) 17(GND) 18(TX) 19(RX) 20(D8) 21(D7) 22(D6) 23(D5) 24(GND) 25(3V3) 26(D4) 27(D3) 28(D2) 29(D1) 30(D0); NODE3 3(VU) 4(S3) 5(S2) 6(S1) 7(SC) 8(SO) 9(SK) 10(GND) 12(EN) 13(RST) 14(GND) 15(Vin) 16(3V3) 17(GND) 18(TX) 19(RX) 21(D7) 22(D6) 23(D5) 24(GND) 25(3V3) 26(D4) 27(D3) 28(D2) 29(D1) 30(D0); NODE4 1(A0) 2(GND) 3(VU) 4(S3) 5(S2) 6(S1) 7(SC) 8(SO) 9(SK) 10(GND) 12(EN) 13(RST) 14(GND) 15(Vin) 16(3V3) 17(GND) 18(TX) 19(RX) 20(D8) 21(D7) 22(D6) 23(D5) 25(3V3) 26(D4) 30(D0); NODE5 1(A0) 2(GND) 3(VU) 4(S3) 5(S2) 6(S1) 7(SC) 8(SO) 9(SK) 10(GND) 11(3V3) 12(EN) 13(RST) 14(GND) 15(Vin) 18(TX) 19(RX) 21(D7) 22(D6) 23(D5) 24(GND) 25(3V3) 26(D4) 27(D3) 28(D2) 29(D1) 30(D0); NODE6 1(A0) 2(GND) 3(VU) 4(S3) 5(S2) 6(S1) 7(SC) 8(SO) 9(SK) 10(GND) 11(3V3) 12(EN) 13(RST) 14(GND) 15(Vin) 17(GND) 18(TX) 19(RX) 20(D8) 21(D7) 22(D6) 23(D5) 25(3V3) 26(D4) 27(D3) 30(D0); NODE7 1(A0) 3(VU) 4(S3) 5(S2) 6(S1) 7(SC) 8(SO) 9(SK) 10(GND) 12(EN) 13(RST) 14(GND) 15(Vin) 16(3V3) 17(GND) 18(TX) 19(RX) 20(D8) 24(GND) 25(3V3) 29(D1) 30(D0); NODE8 1(A0) 3(VU) 4(S3) 5(S2) 6(S1) 7(SC) 8(SO) 9(SK) 10(GND) 11(3V3) 12(EN) 13(RST) 14(GND) 15(Vin) 17(GND) 18(TX) 19(RX) 20(D8) 21(D7) 22(D6) 23(D5) 24(GND) 25(3V3) 26(D4) 27(D3) 30(D0); S1 5(S+) 6(S-); U1 1(RX/PD0/0) 2(TX/PD1/1) 3(INT0/PD2/2) 4(INT1/PWR/PD3/3) 5(PD4/4) 6(PWR/PD5/5) 8(PD7/7) 9(PB0/8) 10(PWR/PB1/9) 11(SS/PWR/PB2/10) 12(MOSI/PWR/PB3/11) 13(MISO/PB4/12) 14(SCK/PB5/13) 15(GND) 16(AREF) 17(SDA) 18(SCL) 19(19/A5/PC5/SCL) 20(18/A4/PC4/SDA) 21(17/A3/PC3) 22(16/A2/PC2) 23(15/A1/PC1) 24(14/A0/PC0) 25(VIN) 27(GND2) 29(3V) 30(RESET) 31(IOREF) 32(NC); U2 1(D1/TX) 2(D0/RX) 3(RESET) 5(D2) 7(D4) 8(D5) 9(D6) 10(D7) 11(D8) 12(D9) 13(D10) 14(D11) 15(D12) 16(D13) 17(3V3) 18(AREF) 19(A0) 20(A1) 21(A2) 22(A3) 23(A4) 24(A5) 25(A6) 26(A7) 28(RESET) 29(GND) 30(VIN); U5 1(GND) 2(VCC) 3(AOUT); U6 1(D1/TX) 2(D0/RX) 3(RESET) 5(D2) 6(D3) 7(D4) 8(D5) 9(D6) 10(D7) 11(D8) 12(D9) 13(D10) 14(D11) 15(D12) 16(D13) 17(3V3) 18(AREF) 20(A1) 21(A2) 22(A3) 23(A4) 24(A5) 25(A6) 26(A7) 28(RESET) 29(GND) 30(VIN); U7 1(RX/PD0/0) 2(TX/PD1/1) 3(INT0/PD2/2) 4(INT1/PWR/PD3/3) 5(PD4/4) 6(PWR/PD5/5) 7(PWR/PD6/6) 8(PD7/7) 9(PB0/8) 10(PWR/PB1/9) 11(SS/PWR/PB2/10) 12(MOSI/PWR/PB3/11) 13(MISO/PB4/12) 14(SCK/PB5/13) 15(GND) 16(AREF) 17(SDA) 18(SCL) 19(19/A5/PC5/SCL) 20(18/A4/PC4/SDA) 21(17/A3/PC3) 22(16/A2/PC2) 23(15/A1/PC1) 25(VIN) 27(GND2) 29(3V) 30(RESET) 31(IOREF) 32(NC); U9 1(D1/TX) 2(D0/RX) 3(RESET) 5(D2) 6(D3) 7(D4) 8(D5) 9(D6) 10(D7) 12(D9) 13(D10) 14(D11) 15(D12) 16(D13) 17(3V3) 18(AREF) 20(A1) 21(A2) 22(A3) 23(A4) 24(A5) 25(A6) 26(A7) 28(RESET) 29(GND) 30(VIN); U10 1(RX/PD0/0) 2(TX/PD1/1) 3(INT0/PD2/2) 4(INT1/PWR/PD3/3) 5(PD4/4) 6(PWR/PD5/5) 7(PWR/PD6/6) 8(PD7/7) 10(PWR/PB1/9) 11(SS/PWR/PB2/10) 12(MOSI/PWR/PB3/11) 13(MISO/PB4/12) 14(SCK/PB5/13) 15(GND) 16(AREF) 17(SDA) 18(SCL) 19(19/A5/PC5/SCL) 20(18/A4/PC4/SDA) 21(17/A3/PC3) 22(16/A2/PC2) 23(15/A1/PC1) 25(VIN) 27(GND2) 29(3V) 30(RESET) 31(IOREF) 32(NC); U15 1(D1/TX) 2(D0/RX) 3(RESET) 4(GND) 5(D2) 6(D3) 7(D4) 8(D5) 9(D6) 10(D7) 11(D8) 12(D9) 13(D10) 14(D11) 15(D12) 16(D13) 17(3V3) 18(AREF) 19(A0) 20(A1) 21(A2) 25(A6) 26(A7) 28(RESET) 30(VIN); U16 1(RX/PD0/0) 2(TX/PD1/1) 3(INT0/PD2/2) 4(INT1/PWR/PD3/3) 5(PD4/4) 6(PWR/PD5/5) 7(PWR/PD6/6) 8(PD7/7) 9(PB0/8) 10(PWR/PB1/9) 11(SS/PWR/PB2/10) 12(MOSI/PWR/PB3/11) 13(MISO/PB4/12) 14(SCK/PB5/13) 15(GND) 16(AREF) 17(SDA) 18(SCL) 22(16/A2/PC2) 23(15/A1/PC1) 24(14/A0/PC0) 25(VIN) 27(GND2) 29(3V) 30(RESET) 31(IOREF) 32(NC); U17 1(D1/TX) 2(D0/RX) 3(RESET) 4(GND) 5(D2) 6(D3) 7(D4) 8(D5) 9(D6) 10(D7) 12(D9) 13(D10) 14(D11) 15(D12) 16(D13) 17(3V3) 18(AREF) 19(A0) 20(A1) 21(A2) 22(A3) 23(A4) 24(A5) 25(A6) 26(A7) 28(RESET) 30(VIN); U18 1(RX/PD0/0) 2(TX/PD1/1) 3(INT0/PD2/2) 4(INT1/PWR/PD3/3) 5(PD4/4) 6(PWR/PD5/5) 7(PWR/PD6/6) 8(PD7/7) 10(PWR/PB1/9) 11(SS/PWR/PB2/10) 12(MOSI/PWR/PB3/11) 13(MISO/PB4/12) 14(SCK/PB5/13) 15(GND) 16(AREF) 17(SDA) 18(SCL) 19(19/A5/PC5/SCL) 20(18/A4/PC4/SDA) 21(17/A3/PC3) 22(16/A2/PC2) 23(15/A1/PC1) 24(14/A0/PC0) 25(VIN) 27(GND2) 29(3V) 30(RESET) 31(IOREF) 32(NC); U19 1(D1/TX) 2(D0/RX) 3(RESET) 4(GND) 5(D2) 6(D3) 7(D4) 8(D5) 9(D6) 10(D7) 11(D8) 12(D9) 13(D10) 14(D11) 15(D12) 16(D13) 17(3V3) 18(AREF) 19(A0) 20(A1) 21(A2) 22(A3) 25(A6) 26(A7) 28(RESET) 30(VIN); U20 1(RX/PD0/0) 2(TX/PD1/1) 3(INT0/PD2/2) 4(INT1/PWR/PD3/3) 5(PD4/4) 6(PWR/PD5/5) 7(PWR/PD6/6) 8(PD7/7) 9(PB0/8) 10(PWR/PB1/9) 11(SS/PWR/PB2/10) 12(MOSI/PWR/PB3/11) 13(MISO/PB4/12) 14(SCK/PB5/13) 15(GND) 16(AREF) 17(SDA) 18(SCL) 21(17/A3/PC3) 22(16/A2/PC2) 23(15/A1/PC1) 24(14/A0/PC0) 25(VIN) 27(GND2) 29(3V) 30(RESET) 31(IOREF) 32(NC); U24 1(D1/TX) 2(D0/RX) 3(RESET) 4(GND) 5(D2) 6(D3) 7(D4) 8(D5) 9(D6) 10(D7) 11(D8) 12(D9) 13(D10) 14(D11) 15(D12) 16(D13) 17(3V3) 18(AREF) 25(A6) 26(A7) 28(RESET) 30(VIN); U25 1(RX/PD0/0) 2(TX/PD1/1) 3(INT0/PD2/2) 4(INT1/PWR/PD3/3) 5(PD4/4) 6(PWR/PD5/5) 7(PWR/PD6/6) 8(PD7/7) 9(PB0/8) 10(PWR/PB1/9) 11(SS/PWR/PB2/10) 12(MOSI/PWR/PB3/11) 13(MISO/PB4/12) 14(SCK/PB5/13) 15(GND) 16(AREF) 17(SDA) 18(SCL) 25(VIN) 27(GND2) 29(3V) 30(RESET) 31(IOREF) 32(NC); U27 1(RX/PD0/0) 2(TX/PD1/1) 3(INT0/PD2/2) 4(INT1/PWR/PD3/3) 5(PD4/4) 6(PWR/PD5/5) 7(PWR/PD6/6) 8(PD7/7) 9(PB0/8) 10(PWR/PB1/9) 11(SS/PWR/PB2/10) 12(MOSI/PWR/PB3/11) 13(MISO/PB4/12) 14(SCK/PB5/13) 15(GND) 16(AREF) 17(SDA) 18(SCL) 21(17/A3/PC3) 22(16/A2/PC2) 23(15/A1/PC1) 24(14/A0/PC0) 25(VIN) 27(GND2) 29(3V) 30(RESET) 31(IOREF) 32(NC); U28 1(D1/TX) 2(D0/RX) 3(RESET) 5(D2) 6(D3) 7(D4) 8(D5) 9(D6) 10(D7) 11(D8) 12(D9) 13(D10) 14(D11) 15(D12) 16(D13) 17(3V3) 18(AREF) 19(A0) 20(A1) 21(A2) 22(A3) 25(A6) 26(A7) 28(RESET) 29(GND) 30(VIN)
